# Altium project UC-526.PrjPCB (part 1 of 2)
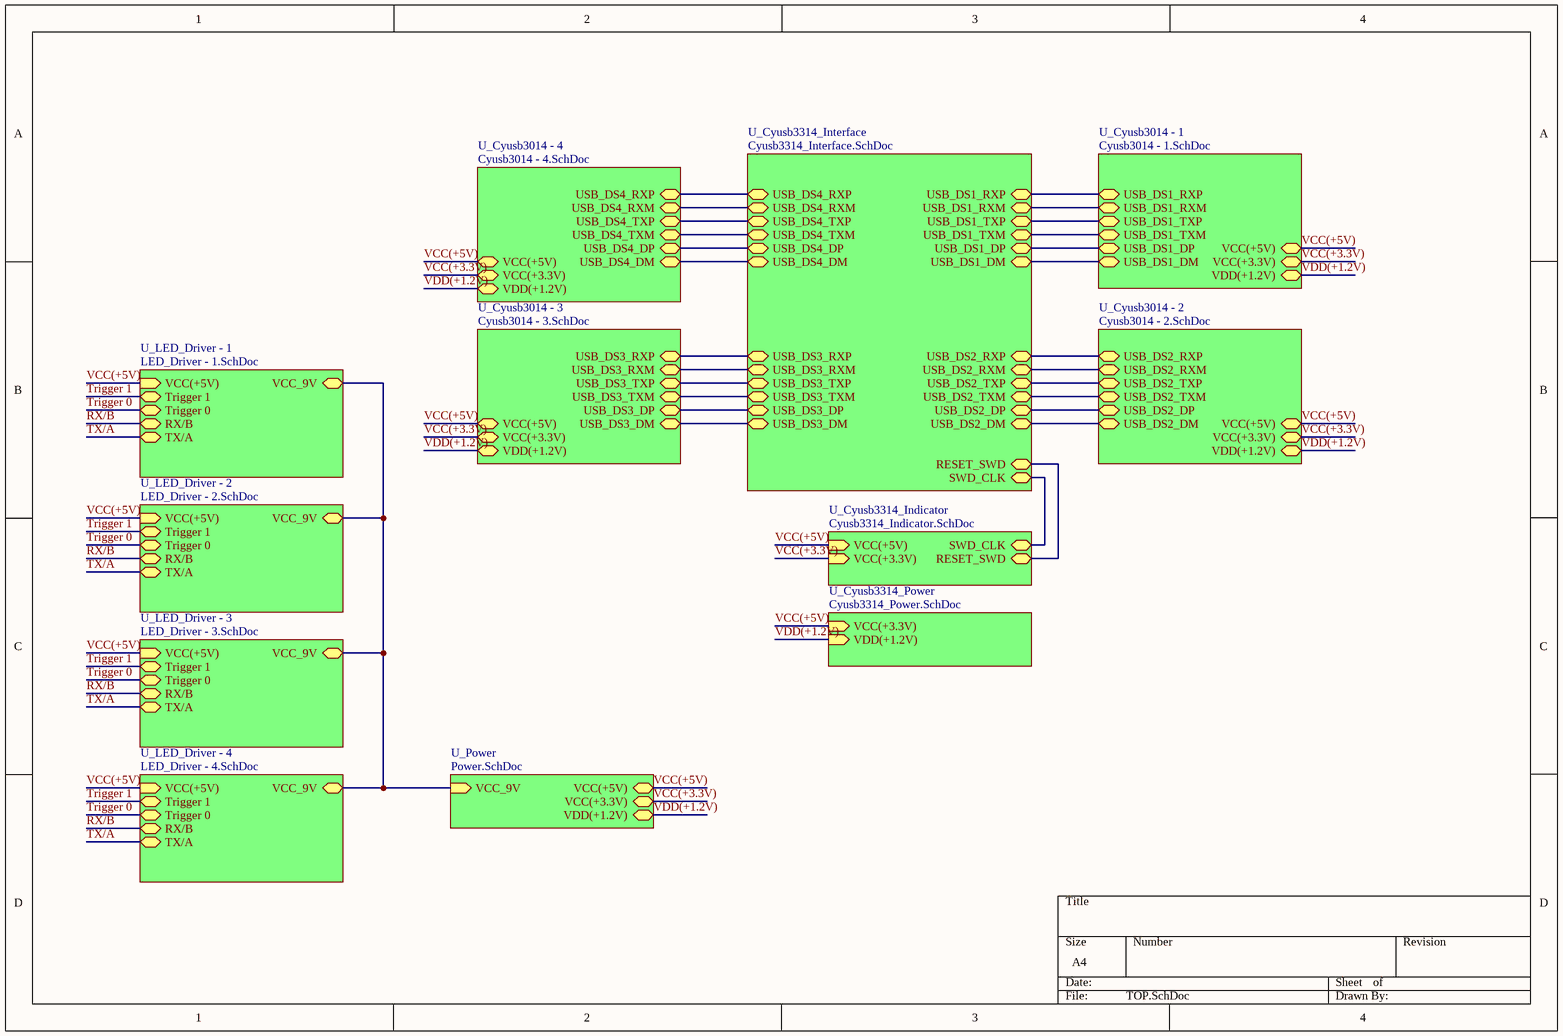
[diagram p0: TOP.SchDoc]
11 sheets, 578 parts. Net scope: hierarchical (ports join the sheet entries above them; power ports are global).
Board files: UC-526 - 1.PcbDoc, UC-526 - 2.PcbDoc, UC-526 - 3.PcbDoc, UC-526 - 4.PcbDoc, UC-526.PcbDoc
Sheets:
  TOP.SchDoc
    U_Power = Power.SchDoc
    U_Cyusb3014 - 2 = Cyusb3014 - 2.SchDoc
    U_Cyusb3014 - 4 = Cyusb3014 - 4.SchDoc
    U_Cyusb3314_Indicator = Cyusb3314_Indicator.SchDoc
    U_Cyusb3314_Interface = Cyusb3314_Interface.SchDoc
    U_Cyusb3314_Power = Cyusb3314_Power.SchDoc
    U_LED_Driver - 1 = LED_Driver - 1.SchDoc
    U_LED_Driver - 2 = LED_Driver - 2.SchDoc
    U_LED_Driver - 3 = LED_Driver - 3.SchDoc
    U_LED_Driver - 4 = LED_Driver - 4.SchDoc

## Sheet TOP.SchDoc
size A4

### Sub-sheets
U_Cyusb3014 - 1 = Cyusb3014 - 1.SchDoc (file not in this document): USB_DS1_RXP (bidir), USB_DS1_RXM (bidir), USB_DS1_TXP (bidir), USB_DS1_TXM (bidir), USB_DS1_DP (bidir), USB_DS1_DM (bidir), VCC(+5V) (bidir), VCC(+3.3V) (bidir), VDD(+1.2V) (bidir)
U_Cyusb3014 - 2 = Cyusb3014 - 2.SchDoc: USB_DS2_RXP (bidir), USB_DS2_RXM (bidir), USB_DS2_TXP (bidir), USB_DS2_TXM (bidir), USB_DS2_DP (bidir), USB_DS2_DM (bidir), VCC(+5V) (bidir), VCC(+3.3V) (bidir), VDD(+1.2V) (bidir)
U_Cyusb3014 - 3 = Cyusb3014 - 3.SchDoc (file not in this document): USB_DS3_RXP (bidir), USB_DS3_RXM (bidir), USB_DS3_TXP (bidir), USB_DS3_TXM (bidir), USB_DS3_DP (bidir), USB_DS3_DM (bidir), VCC(+5V) (bidir), VCC(+3.3V) (bidir), VDD(+1.2V) (bidir)
U_Cyusb3014 - 4 = Cyusb3014 - 4.SchDoc: USB_DS4_RXP (bidir), USB_DS4_RXM (bidir), USB_DS4_TXP (bidir), USB_DS4_TXM (bidir), USB_DS4_DP (bidir), USB_DS4_DM (bidir), VCC(+5V) (bidir), VCC(+3.3V) (bidir), VDD(+1.2V) (bidir)
U_Cyusb3314_Indicator = Cyusb3314_Indicator.SchDoc: SWD_CLK (bidir), RESET_SWD (bidir), VCC(+5V) (in), VCC(+3.3V) (in)
U_Cyusb3314_Interface = Cyusb3314_Interface.SchDoc: RESET_SWD (bidir), SWD_CLK (bidir), USB_DS1_RXP (bidir), USB_DS1_RXM (bidir), USB_DS1_TXP (bidir), USB_DS1_TXM (bidir), USB_DS1_DP (bidir), USB_DS1_DM (bidir), USB_DS2_RXP (bidir), USB_DS2_RXM (bidir), USB_DS2_TXP (bidir), USB_DS2_TXM (bidir), USB_DS2_DP (bidir), USB_DS2_DM (bidir), USB_DS3_RXP (bidir), USB_DS3_RXM (bidir), USB_DS3_TXP (bidir), USB_DS3_TXM (bidir), USB_DS3_DP (bidir), USB_DS3_DM (bidir), USB_DS4_RXP (bidir), USB_DS4_RXM (bidir), USB_DS4_TXP (bidir), USB_DS4_TXM (bidir), USB_DS4_DP (bidir), USB_DS4_DM (bidir)
U_Cyusb3314_Power = Cyusb3314_Power.SchDoc: VCC(+3.3V) (in), VDD(+1.2V) (in)
U_LED_Driver - 1 = LED_Driver - 1.SchDoc: VCC_9V (bidir), VCC(+5V) (in), Trigger 1 (bidir), Trigger 0 (bidir), RX/B (bidir), TX/A (bidir)
U_LED_Driver - 2 = LED_Driver - 2.SchDoc: VCC_9V (bidir), VCC(+5V) (in), Trigger 1 (bidir), Trigger 0 (bidir), RX/B (bidir), TX/A (bidir)
U_LED_Driver - 3 = LED_Driver - 3.SchDoc: VCC_9V (bidir), VCC(+5V) (in), Trigger 1 (bidir), Trigger 0 (bidir), RX/B (bidir), TX/A (bidir)
U_LED_Driver - 4 = LED_Driver - 4.SchDoc: VCC_9V (bidir), VCC(+5V) (in), Trigger 1 (bidir), Trigger 0 (bidir), RX/B (bidir), TX/A (bidir)
U_Power = Power.SchDoc: VCC_9V (in), VCC(+5V) (bidir), VCC(+3.3V) (bidir), VDD(+1.2V) (bidir)

### Nets
RX/B: sheet U_LED_Driver - 1/RX/B, sheet U_LED_Driver - 2/RX/B, sheet U_LED_Driver - 3/RX/B, sheet U_LED_Driver - 4/RX/B
Trigger 0: sheet U_LED_Driver - 1/Trigger 0, sheet U_LED_Driver - 2/Trigger 0, sheet U_LED_Driver - 3/Trigger 0, sheet U_LED_Driver - 4/Trigger 0
Trigger 1: sheet U_LED_Driver - 1/Trigger 1, sheet U_LED_Driver - 2/Trigger 1, sheet U_LED_Driver - 3/Trigger 1, sheet U_LED_Driver - 4/Trigger 1
TX/A: sheet U_LED_Driver - 1/TX/A, sheet U_LED_Driver - 2/TX/A, sheet U_LED_Driver - 3/TX/A, sheet U_LED_Driver - 4/TX/A
USB_DS1_DM: sheet U_Cyusb3014 - 1/USB_DS1_DM, sheet U_Cyusb3314_Interface/USB_DS1_DM
USB_DS1_DP: sheet U_Cyusb3014 - 1/USB_DS1_DP, sheet U_Cyusb3314_Interface/USB_DS1_DP
USB_DS1_RXM: sheet U_Cyusb3014 - 1/USB_DS1_RXM, sheet U_Cyusb3314_Interface/USB_DS1_RXM
USB_DS1_RXP: sheet U_Cyusb3014 - 1/USB_DS1_RXP, sheet U_Cyusb3314_Interface/USB_DS1_RXP
USB_DS1_TXM: sheet U_Cyusb3014 - 1/USB_DS1_TXM, sheet U_Cyusb3314_Interface/USB_DS1_TXM
USB_DS1_TXP: sheet U_Cyusb3014 - 1/USB_DS1_TXP, sheet U_Cyusb3314_Interface/USB_DS1_TXP
USB_DS2_DM: sheet U_Cyusb3014 - 2/USB_DS2_DM, sheet U_Cyusb3314_Interface/USB_DS2_DM
USB_DS2_DP: sheet U_Cyusb3014 - 2/USB_DS2_DP, sheet U_Cyusb3314_Interface/USB_DS2_DP
USB_DS2_RXM: sheet U_Cyusb3014 - 2/USB_DS2_RXM, sheet U_Cyusb3314_Interface/USB_DS2_RXM
USB_DS2_RXP: sheet U_Cyusb3014 - 2/USB_DS2_RXP, sheet U_Cyusb3314_Interface/USB_DS2_RXP
USB_DS2_TXM: sheet U_Cyusb3014 - 2/USB_DS2_TXM, sheet U_Cyusb3314_Interface/USB_DS2_TXM
USB_DS2_TXP: sheet U_Cyusb3014 - 2/USB_DS2_TXP, sheet U_Cyusb3314_Interface/USB_DS2_TXP
USB_DS3_DM: sheet U_Cyusb3014 - 3/USB_DS3_DM, sheet U_Cyusb3314_Interface/USB_DS3_DM
USB_DS3_DP: sheet U_Cyusb3014 - 3/USB_DS3_DP, sheet U_Cyusb3314_Interface/USB_DS3_DP
USB_DS3_RXM: sheet U_Cyusb3014 - 3/USB_DS3_RXM, sheet U_Cyusb3314_Interface/USB_DS3_RXM
USB_DS3_RXP: sheet U_Cyusb3014 - 3/USB_DS3_RXP, sheet U_Cyusb3314_Interface/USB_DS3_RXP
USB_DS3_TXM: sheet U_Cyusb3014 - 3/USB_DS3_TXM, sheet U_Cyusb3314_Interface/USB_DS3_TXM
USB_DS3_TXP: sheet U_Cyusb3014 - 3/USB_DS3_TXP, sheet U_Cyusb3314_Interface/USB_DS3_TXP
USB_DS4_DM: sheet U_Cyusb3014 - 4/USB_DS4_DM, sheet U_Cyusb3314_Interface/USB_DS4_DM
USB_DS4_DM: sheet U_Cyusb3014 - 4/USB_DS4_DP, sheet U_Cyusb3314_Interface/USB_DS4_DP  [a separate net that carries the same name]
USB_DS4_RXM: sheet U_Cyusb3014 - 4/USB_DS4_RXM, sheet U_Cyusb3314_Interface/USB_DS4_RXM
USB_DS4_RXP: sheet U_Cyusb3014 - 4/USB_DS4_RXP, sheet U_Cyusb3314_Interface/USB_DS4_RXP
USB_DS4_TXM: sheet U_Cyusb3014 - 4/USB_DS4_TXM, sheet U_Cyusb3314_Interface/USB_DS4_TXM
USB_DS4_TXP: sheet U_Cyusb3014 - 4/USB_DS4_TXP, sheet U_Cyusb3314_Interface/USB_DS4_TXP
VCC(+3.3V): sheet U_Power/VCC(+3.3V), sheet U_Cyusb3014 - 1/VCC(+3.3V), sheet U_Cyusb3014 - 2/VCC(+3.3V), sheet U_Cyusb3014 - 3/VCC(+3.3V), sheet U_Cyusb3014 - 4/VCC(+3.3V), sheet U_Cyusb3314_Indicator/VCC(+3.3V)
VCC(+5V): sheet U_Power/VCC(+5V), sheet U_Cyusb3014 - 1/VCC(+5V), sheet U_Cyusb3014 - 2/VCC(+5V), sheet U_Cyusb3014 - 3/VCC(+5V), sheet U_Cyusb3014 - 4/VCC(+5V), sheet U_Cyusb3314_Indicator/VCC(+5V), sheet U_Cyusb3314_Power/VCC(+3.3V), sheet U_LED_Driver - 1/VCC(+5V), sheet U_LED_Driver - 2/VCC(+5V), sheet U_LED_Driver - 3/VCC(+5V), sheet U_LED_Driver - 4/VCC(+5V)
VDD(+1.2V): sheet U_Power/VDD(+1.2V), sheet U_Cyusb3014 - 1/VDD(+1.2V), sheet U_Cyusb3014 - 2/VDD(+1.2V), sheet U_Cyusb3014 - 3/VDD(+1.2V), sheet U_Cyusb3014 - 4/VDD(+1.2V), sheet U_Cyusb3314_Power/VDD(+1.2V)
NetC188_1: sheet U_Cyusb3314_Indicator/RESET_SWD, sheet U_Cyusb3314_Interface/RESET_SWD
NetJ11_4: sheet U_Cyusb3314_Indicator/SWD_CLK, sheet U_Cyusb3314_Interface/SWD_CLK
(unnamed): sheet U_Power/VCC_9V, sheet U_LED_Driver - 1/VCC_9V, sheet U_LED_Driver - 2/VCC_9V, sheet U_LED_Driver - 3/VCC_9V, sheet U_LED_Driver - 4/VCC_9V

## Sheet Power.SchDoc
size A4
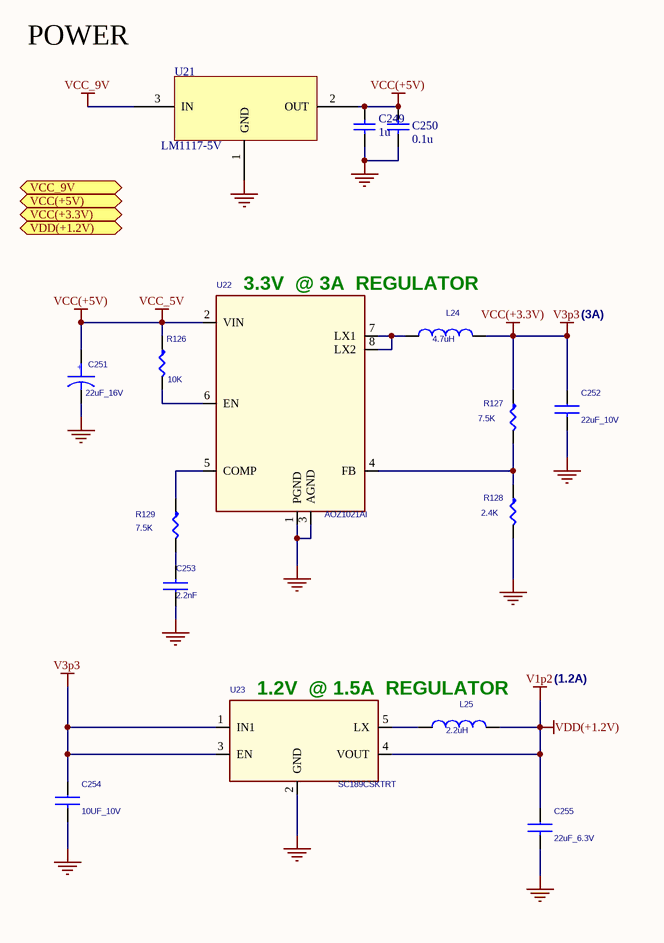
[diagram p1: Power.SchDoc]

### Parts
C249  1u  [C0603]
C250  0.1u  [C0603]
C251  22uF_16V  [CAPCP3216X100M]
C252  22uF_10V  [CAPC3216X100M]
C253  2.2nF  [CAPC2112X70M]
C254  10UF_10V  [CAPC2012X145M]
C255  22uF_6.3V  [CAPC3216X100M]
L24  4.7uH  [IND_NR6028T4R7M]
L25  2.2uH  [INDP3225X240M]
R126  10K  [RESC1608X55M]
R127  7.5K  [RESC1608X55M]
R128  2.4K  [RESC1608X55M]
R129  7.5K  [RESC1608X55M]
U21  LM1117-5V  [SOT-223]
U22  AOZ1021AI  [SOIC127P600X175-8M]
U23  SC189CSKTRT  [SOT95P280X145-5M]

### Ports
VCC(+3.3V) (bidir), VCC(+5V) (bidir), VCC_9V (in), VDD(+1.2V) (bidir)

### Nets
GND: C249.1 C250.2 C251.2 C252.2 C253.1 C254.2 C255.2 R128.2 U21.1(GND) U22.1(PGND) U22.3(AGND) U23.2(GND)
V1p2: C255.1 L25.2 U23.4(VOUT)  [also labelled VDD(+1.2V)]  [project net DVDD12]
V3p3: C252.1 C254.1 L24.2 R127.1 U23.1(IN1) U23.3(EN)  [also labelled VCC(+3.3V)]  [project net SWD_IO]
VCC(+5V): C249.2 C250.1 C251.1 R126.1 U21.2(OUT) U22.2(VIN)  [also labelled VCC_5V]
VCC_9V: U21.3(IN)
NetC253_2: C253.2 R129.2
NetL24_1: L24.1 U22.7(LX1) U22.8(LX2)
NetL25_1: L25.1 U23.5(LX)
NetR126_2: R126.2 U22.6(EN)
NetR127_2: R127.2 R128.1 U22.4(FB)
NetR129_1: R129.1 U22.5(COMP)

### Notes on the sheet
- POWER
- 3.3V  @ 3A  REGULATOR
- (3A)
- 1.2V  @ 1.5A  REGULATOR
- (1.2A)
- (in symbol CAP POL) +

### Library data of the parts
C249 = Cap: 50V/8.2u/0805; Value: 100n; Published: 8-Jun-2000; LatestRevisionDate: 17-Jul-2002; LatestRevisionNote: Re-released for DXP Platform.; PackageReference: RAD-0.3; Publisher: Altium Limited
C250 = CAP0805: Capacitor; Value: 104; Published: 8-Jun-2000; Revision: July-2002: Re-released for DXP Platform.; Publisher: Altium Limited
C251 = CAP POL: CAP TANT 22UF 16V 10% 1206; Manufacturer: Nichicon; Part Number: F951C226KQAAQ2; RoHS Compliant: Yes; Lead Free Status: No
C252 C254 C255 = CAPACITOR NON-POL: Manufacturer: *; Part Number: *
C253 = CAPACITOR NON-POL: CAP CER 2200PF 50V 10% X7R 0805; Manufacturer: Yageo; Part Number: CC0805KRX7R9BB222; Num Pins: 2; RoHS Compliant: Yes; Lead Free: YES
L24 = INDUCTOR: INDUCTOR 4.7UH 2.7A 20% SMD; Part Number: NR6028T4R7M; Manufacturer: Taiyo Yuden; Lead Free: YES
L25 = INDUCTOR: INDUCTOR 2.2UH 1.20A 20% 1210; Part Number: NLCV32T-2R2M-PFR; Manufacturer: TDK Corporation; Lead Free: YES
R126 = R_Dup1: RES 10.0K OHM 1/10W 1% 0603 SMD; Manufacturer: Panasonic - ECG; Part Number: ERJ-3EKF1002V; Lead Free: YES
R127 = R_Dup1: RES 7.5K OHM 1/10W 1% 0603 SMD; Manufacturer: Panasonic - ECG; Part Number: ERJ-3EKF7501V; Lead Free: YES
R128 = R_Dup1: RES 2.4K OHM 1/10W 1% 0603 SMD; Manufacturer: Panasonic - ECG; Part Number: ERJ-3EKF2401V; Lead Free: YES
R129 = R_Dup1: RES 7.5K OHM 1/10W 1% 0603 SMD; Part Number: ERJ-3EKF7501V; Manufacturer: Panasonic - ECG; Lead Free: YES
U21 = AMS1117
U22 = AOZ1021AI: IC REG BUCK SYNC ADJ 3A 8SOIC; Manufacturer: Alpha & Omega Semiconductor Inc; Part Number: AOZ1021AI
U23 = SC189CSKTRT: IC REG BUCK SYNC 1.2V SOT23-5; Manufacturer: Semtech; Part Number: SC189CSKTRT

## Sheet Cyusb3014 - 2.SchDoc
size A3
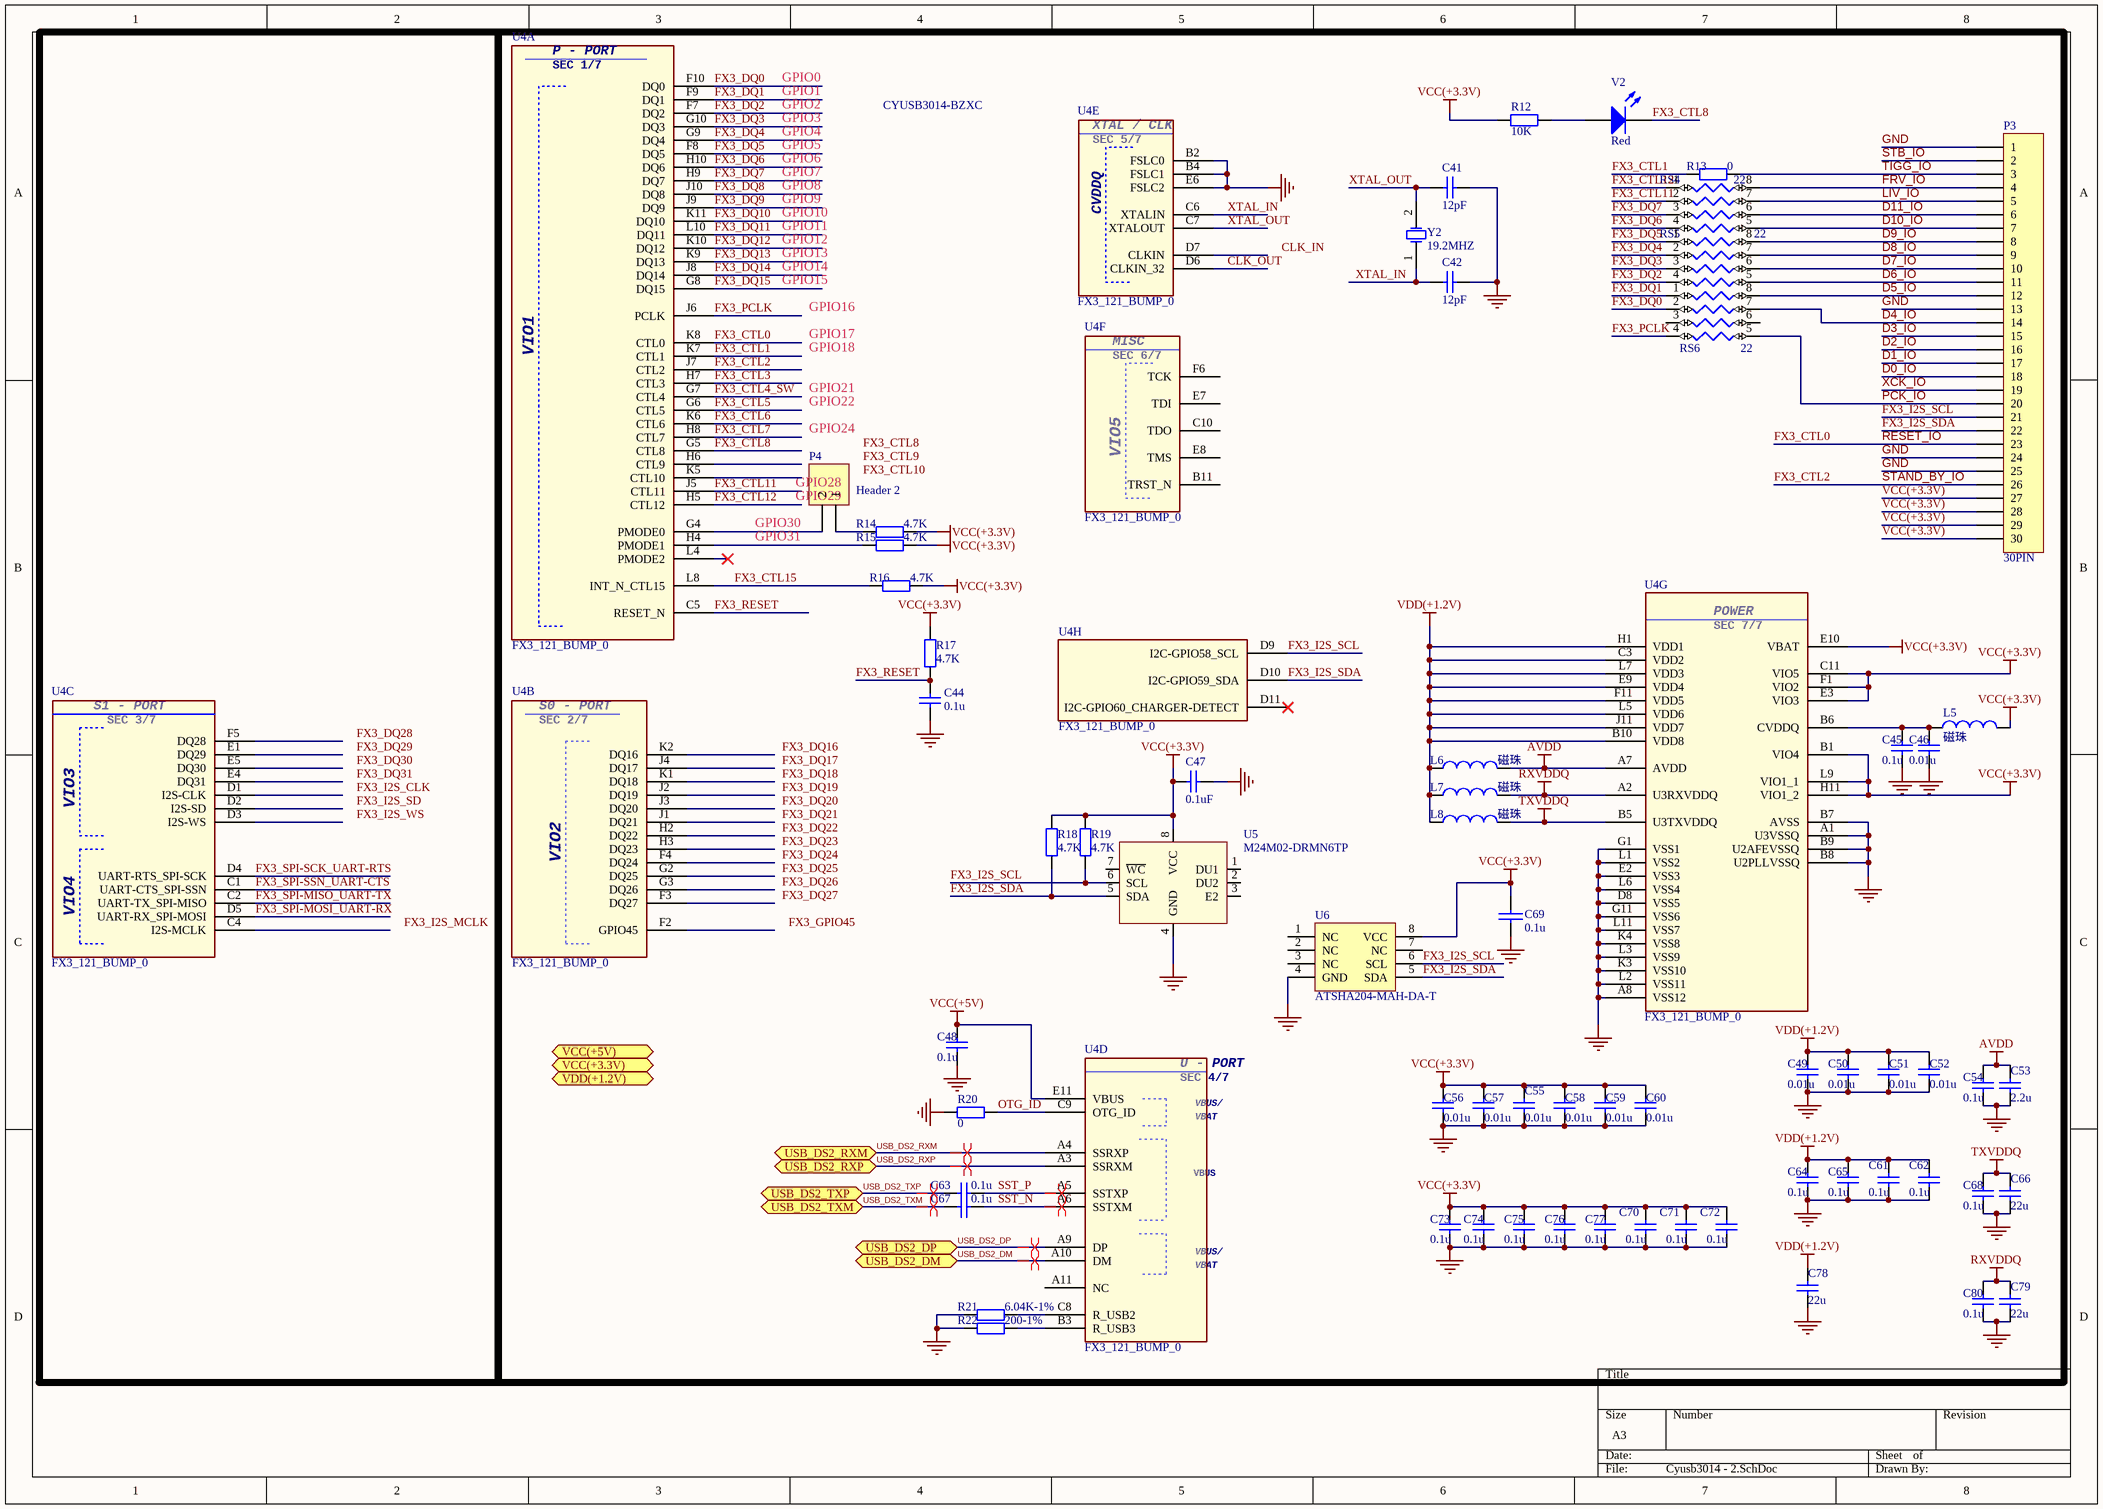
[diagram p2: Cyusb3014 - 2.SchDoc]

### Parts
C41  12pF  [0603S-CAP]
C42  12pF  [0603S-CAP]
C44  0.1u  [0603S-CAP]
C45  0.1u  [C0402]
C46  0.01u  [C0402]
C47  0.1uF  [0603S-CAP]
C48  0.1u  [C0402]
C49  0.01u  [C0402]
C50  0.01u  [C0402]
C51  0.01u  [C0402]
C52  0.01u  [C0402]
C53  2.2u  [C0805S-CAP]
C54  0.1u  [C0402]
C55  0.01u  [C0402]
C56  0.01u  [C0402]
C57  0.01u  [C0402]
C58  0.01u  [C0402]
C59  0.01u  [C0402]
C60  0.01u  [C0402]
C61  0.1u  [C0402]
C62  0.1u  [C0402]
C63  0.1u  [C0402]
C64  0.1u  [C0402]
C65  0.1u  [C0402]
C66  22u  [C0805S-CAP]
C67  0.1u  [C0402]
C68  0.1u  [C0402]
C69  0.1u  [0603S-CAP]
C70  0.1u  [C0402]
C71  0.1u  [C0402]
C72  0.1u  [C0402]
C73  0.1u  [C0402]
C74  0.1u  [C0402]
C75  0.1u  [C0402]
C76  0.1u  [C0402]
C77  0.1u  [C0402]
C78  22u  [C0805S-CAP]
C79  22u  [C0805S-CAP]
C80  0.1u  [C0402]
L5  磁珠  [L0603]
L6  磁珠  [L0603]
L7  磁珠  [L0603]
L8  磁珠  [L0603]
P3  30PIN  [FH12-30S-0.5SH]
P4  Header 2  [HDR1X2]
R12  10K  [0603S-RES]
R13  0  [0603S-RES]
R14  4.7K  [0603S-RES]
R15  4.7K  [0603S-RES]
R16  4.7K  [0603S-RES]
R17  4.7K  [0603S-RES]
R18  4.7K  [0603S-RES]
R19  4.7K  [0603S-RES]
R20  0  [0603S-RES]
R21  6.04K-1%  [0603S-RES]
R22  200-1%  [0603S-RES]
RS4  22  [NC06-4]
RS5  22  [NC06-4]
RS6  22  [NC06-4]
U4  FX3_121_BUMP_0  [121_BGA_FX3]  (parts A,B,C,D,E,F,G,H of 8)
U5  M24M02-DRMN6TP  [SOIC127P600X175-8N]
U6  ATSHA204-MAH-DA-T  [UDFN]
V2  Red  [LED0805S]
Y2  19.2MHZ  [爱普生晶振3.2×2.5MM - 无源]

### Ports
USB_DS2_DM (bidir), USB_DS2_DP (bidir), USB_DS2_RXM (bidir), USB_DS2_RXP (bidir), USB_DS2_TXM (bidir), USB_DS2_TXP (bidir), VCC(+3.3V) (bidir), VCC(+5V) (bidir), VDD(+1.2V) (bidir)

### Nets
AVDD: C53.2 C54.1 L6.2 U4.A7(AVDD)
GND: C41.1 C42.1 C44.1 C45.2 C46.2 C47.1 C48.2 C49.2 C50.2 C51.2 C52.2 C53.1 C54.2 C55.2 C56.2 C57.2 C58.2 C59.2 C60.2 C61.2 C62.2 C64.2 C65.2 C66.1 C68.2 C69.2 C70.2 C71.2 C72.2 C73.2 C74.2 C75.2 C76.2 C77.2 C78.1 C79.1 C80.2 P3.1 P3.13 P3.24 P3.25 R20.2 R21.2 R22.2 U4.A1(U3VSSQ) U4.A8(VSS12) U4.B2(FSLC0) U4.B4(FSLC1) U4.B7(AVSS) U4.B8(U2PLLVSSQ) U4.B9(U2AFEVSSQ) U4.D8(VSS5) U4.E2(VSS3) U4.E6(FSLC2) U4.G1(VSS1) U4.G11(VSS6) U4.K3(VSS10) U4.K4(VSS8) U4.L1(VSS2) U4.L2(VSS11) U4.L3(VSS9) U4.L6(VSS4) U4.L11(VSS7) U5.4(GND) U6.4(GND)
RXVDDQ: C79.2 C80.1 L7.2 U4.A2(U3RXVDDQ)
TXVDDQ: C66.2 C68.1 L8.2 U4.B5(U3TXVDDQ)
VCC(+3.3V): C47.2 C55.1 C56.1 C57.1 C58.1 C59.1 C60.1 C69.1 C70.1 C71.1 C72.1 C73.1 C74.1 C75.1 C76.1 C77.1 L5.2 P3.27 P3.28 P3.29 P3.30 R12.2 R14.2 R15.2 R16.1 R17.1 R18.2 R19.2 U4.B1(VIO4) U4.C11(VIO5) U4.E3(VIO3) U4.E10(VBAT) U4.F1(VIO2) U4.H11(VIO1_2) U4.L9(VIO1_1) U5.8(VCC) U6.8(VCC)  [project net SWD_IO]
VCC(+5V): C48.1 U4.E11(VBUS)
VDD(+1.2V): C49.1 C50.1 C51.1 C52.1 C61.1 C62.1 C64.1 C65.1 C78.2 L6.1 L7.1 L8.1 U4.B10(VDD8) U4.C3(VDD2) U4.E9(VDD4) U4.F11(VDD5) U4.H1(VDD1) U4.J11(VDD7) U4.L5(VDD6) U4.L7(VDD3)  [project net DVDD12]
CLK_OUT: U4.D6(CLKIN_32)
D0_IO: P3.18
D1_IO: P3.17
D2_IO: P3.16
D3_IO: P3.15
D4_IO: P3.14 RS6.7
D5_IO: P3.12 RS6.8
D6_IO: P3.11 RS5.5
D7_IO: P3.10 RS5.6
D8_IO: P3.9 RS5.7
D9_IO: P3.8 RS5.8
D10_IO: P3.7 RS4.5
D11_IO: P3.6 RS4.6
FRV_IO: P3.4 RS4.8
FX3_CTL0: P3.23 U4.K8(CTL0)  [also labelled RESET_IO]
FX3_CTL1: R13.2 U4.K7(CTL1)
FX3_CTL2: P3.26 U4.J7(CTL2)  [also labelled STAND_BY_IO]
FX3_CTL3: U4.H7(CTL3)
FX3_CTL4_SW: U4.G7(CTL4)
FX3_CTL5: U4.G6(CTL5)
FX3_CTL6: U4.K6(CTL6)
FX3_CTL7: U4.H8(CTL7)
FX3_CTL8: U4.G5(CTL8) V2.2(K)
FX3_CTL11: RS4.2 U4.J5(CTL11)
FX3_CTL12: RS4.1 U4.H5(CTL12)
FX3_CTL15: R16.2 U4.L8(INT_N_CTL15)
FX3_DQ0: RS6.2 U4.F10(DQ0)
FX3_DQ1: RS6.1 U4.F9(DQ1)
FX3_DQ2: RS5.4 U4.F7(DQ2)
FX3_DQ3: RS5.3 U4.G10(DQ3)
FX3_DQ4: RS5.2 U4.G9(DQ4)
FX3_DQ5: RS5.1 U4.F8(DQ5)
FX3_DQ6: RS4.4 U4.H10(DQ6)
FX3_DQ7: RS4.3 U4.H9(DQ7)
FX3_DQ8: U4.J10(DQ8)
FX3_DQ9: U4.J9(DQ9)
FX3_DQ10: U4.K11(DQ10)
FX3_DQ11: U4.L10(DQ11)
FX3_DQ12: U4.K10(DQ12)
FX3_DQ13: U4.K9(DQ13)
FX3_DQ14: U4.J8(DQ14)
FX3_DQ15: U4.G8(DQ15)
FX3_I2S_SCL: P3.21 R19.1 U4.D9(I2C-GPIO58_SCL) U5.6(SCL) U6.6(SCL)
FX3_I2S_SDA: P3.22 R18.1 U4.D10(I2C-GPIO59_SDA) U5.5(SDA) U6.5(SDA)
FX3_PCLK: RS6.4 U4.J6(PCLK)
FX3_RESET: C44.2 R17.2 U4.C5(RESET_N)
FX3_SPI-MISO_UART-TX: U4.C2(UART-TX_SPI-MISO)
FX3_SPI-MOSI_UART-RX: U4.D5(UART-RX_SPI-MOSI)
FX3_SPI-SCK_UART-RTS: U4.D4(UART-RTS_SPI-SCK)
FX3_SPI-SSN_UART-CTS: U4.C1(UART-CTS_SPI-SSN)
LIV_IO: P3.5 RS4.7
OTG_ID: R20.1 U4.C9(OTG_ID)
PCK_IO: P3.20 RS6.5
SST_N: C67.2 U4.A6(SSTXM)
SST_P: C63.2 U4.A5(SSTXP)
STB_IO: P3.2
TIGG_IO: P3.3 R13.1
USB_DS2_DM: U4.A10(DM) ; port USB_DS2_DM
USB_DS2_DP: U4.A9(DP) ; port USB_DS2_DP
USB_DS2_RXM: U4.A4(SSRXP) ; port USB_DS2_RXM
USB_DS2_RXP: U4.A3(SSRXM) ; port USB_DS2_RXP
USB_DS2_TXM: C67.1 ; port USB_DS2_TXM
USB_DS2_TXP: C63.1 ; port USB_DS2_TXP
XCK_IO: P3.19
XTAL_IN: C42.2 U4.C6(XTALIN) Y2.1(OSC1)
XTAL_OUT: C41.2 U4.C7(XTALOUT) Y2.2(OSC2)
NetC45_1: C45.1 C46.1 L5.1 U4.B6(CVDDQ)
NetP4_1: P4.1 R14.1
NetP4_2: P4.2 U4.G4(PMODE0)
NetR12_1: R12.1 V2.1(A)
NetR15_1: R15.1 U4.H4(PMODE1)
NetR21_1: R21.1 U4.C8(R_USB2)
NetR22_1: R22.1 U4.B3(R_USB3)

Not connected (* = marked no-connect by the designer): RS6 3 6; U4 A11(NC) B11(TRST_N) C4(I2S-MCLK) C10(TDO) D1(I2S-CLK) D2(I2S-SD) D3(I2S-WS) D7(CLKIN) D11(I2C-GPIO60_CHARGER-DETECT)* E1(DQ29) E4(DQ31) E5(DQ30) E7(TDI) E8(TMS) F2(GPIO45) F3(DQ27) F4(DQ24) F5(DQ28) F6(TCK) G2(DQ25) G3(DQ26) H2(DQ22) H3(DQ23) H6(CTL9) J1(DQ21) J2(DQ19) J3(DQ20) J4(DQ17) K1(DQ18) K2(DQ16) K5(CTL10) L4(PMODE2)*; U5 1(DU1) 2(DU2) 3(E2) 7(~{WC}); U6 1(NC) 2(NC) 3(NC) 7(NC)

### Layout directives
differential pair: SST_N, SST_P, USB_DS2_DM, USB_DS2_DP, USB_DS2_RXM, USB_DS2_RXP, USB_DS2_TXM, USB_DS2_TXP

### Notes on the sheet
- GPIO0
- GPIO1
- GPIO2
- CYUSB3014-BZXC
- GPIO3
- GPIO4
- GPIO5
- GPIO6
- GPIO7
- GPIO8
- GPIO9
- GPIO10
- GPIO11
- GPIO12
- GPIO13
- GPIO14
- GPIO15
- GPIO16
- GPIO17
- GPIO18
- GPIO21
- GPIO22
- GPIO24
- (near P4) GPIO28
- (near P4) GPIO29
- (near P4) GPIO30
- (near P4) GPIO31
- Labels drawn without touching a wire or pin: CLK_IN, FX3_CTL8, FX3_CTL9, FX3_CTL10, FX3_DQ16, FX3_DQ17, FX3_DQ18, FX3_DQ19, FX3_DQ20, FX3_DQ21, FX3_DQ22, FX3_DQ23, FX3_DQ24, FX3_DQ25, FX3_DQ26, FX3_DQ27, FX3_DQ28, FX3_DQ29, FX3_DQ30, FX3_DQ31, FX3_GPIO45, FX3_I2S_CLK, FX3_I2S_MCLK, FX3_I2S_SD, FX3_I2S_WS
- (in symbol FX3_121_BUMP_0, part A) P - PORT; SEC 1/7; VIO1
- (in symbol FX3_121_BUMP_0, part B) S0 - PORT; SEC 2/7
- (in symbol FX3_121_BUMP_0, part C) S1 - PORT; SEC 3/7
- (in symbol FX3_121_BUMP_0, part D) U - PORT; SEC 4/7; VBUS/
- (in symbol FX3_121_BUMP_0, part E) XTAL / CLK; SEC 5/7
- (in symbol FX3_121_BUMP_0, part F) MISC; SEC 6/7
- (in symbol FX3_121_BUMP_0, part G) POWER; SEC 7/7

### Library data of the parts
C41 C42 = CAP CER SMT 4.3pF 0805: 2. Manufacturere Part Number: C0805C439D5GACTU; 1. Manufacturer: Kemet; 8. Alternate Part: any; 7. Package / Case: 0805; 0. Do Not Install: DNI; 6. Mounting Type: SMT; 5. Supplier Link: http://www.digikey.com/product-detail/en/C0805C439D5GACTU/C0805C439D5GACTU-ND/2212763; 3. Supplier: Digi-Key; 4. Supplier Part Number: C0805C439D5GACTU-ND
C44 = Cap: 50V/8.2u/0805; Value: 100n; Published: 8-Jun-2000; LatestRevisionDate: 17-Jul-2002; LatestRevisionNote: Re-released for DXP Platform.; PackageReference: RAD-0.3; Publisher: Altium Limited
C45 C46 C48-C68 C70-C80 = CAP0805: Capacitor; Value: 104; Published: 8-Jun-2000; Revision: July-2002: Re-released for DXP Platform.; Publisher: Altium Limited
C47 = CAP SMT 0.1uF 16V X7R: 2. Manufacturere Part Number: C0805C104K4RACTU; 1. Manufacturer: Kemet; 8. Alternate Part: any; 7. Package / Case: 0805; 6. Mounting Type: SMT; 5. Supplier Link: http://www.digikey.com/product-detail/en/C0805C104K4RACTU/399-1167-1-ND/411442; 3. Supplier: Digi-Key; 4. Supplier Part Number: 399-1167-1-ND
C69 = CAP: RC=1206
L5-L8 = Inductor: Code_IEC: 1005; Value: 10mH; Published: 8-Jun-2000; LatestRevisionDate: 29-May-2009; LatestRevisionNote: IPC-7351 Footprint Added.; PackageReference: 0402-A; Publisher: Altium Limited; PackageDescription: Chip Inductor; Code_JEITA: 0402
P3 = Header 30: Header, 30-Pin; LatestRevisionDate: 17-Jul-2002; LatestRevisionNote: Re-released for DXP Platform.; Publisher: Altium Limited
P4 = Header 2: Header, 2-Pin; LatestRevisionDate: 17-Jul-2002; LatestRevisionNote: Re-released for DXP Platform.; Publisher: Altium Limited
R12 = Res2: Resistor; Published: 8-Jun-2000; LatestRevisionDate: 17-Jul-2002; LatestRevisionNote: Re-released for DXP Platform.; PackageReference: AXIAL-0.4; Publisher: Altium Limited; Value: 10K
R13-R22 = Res2: Resistor; Value: 10K; Published: 8-Jun-2000; LatestRevisionDate: 17-Jul-2002; LatestRevisionNote: Re-released for DXP Platform.; PackageReference: AXIAL-0.4; Publisher: Altium Limited
RS4-RS6 = RN4: Option 2 - Device: *; Option 2 - Spec: *; Option 3 - Device: *; Option 3 - Spec: *; Option 4 - Device: *; Option 4 - Spec: *; Option 5 - Device: *; Option 5 - Spec: *; Option 6 - Device: *; Option 6 - Spec: *; Option 7 - Device: *; Option 7 - Spec: *; Option 8 - Device: *; Option 8 - Spec: *
U5 = 24LC64-I/SN: IC EEPROM 64KBIT 400KHZ 8SOIC; Manufacturer: Microchip Technology; Format - Memory: EEPROMs - Serial; Memory Size: 64K (8K x 8); Interface: I2C, 2-Wire Serial; Voltage - Supply: 2.5 V ~ 5.5 V; Supplier 1: Digi-Key; Manufacturer Part Number: 24LC64-I/SN; RoHS: RoHS Compliant; Category: Integrated Circuits (ICs); Stock 1: 16323; Pricing 1: 1=0.38, 25=0.37, 100=0.35 (USD); Packaging: Tube; Memory Type: EEPROM; Speed: 400kHz; Operating Temperature: -40°C ~ 85°C (TA); Package / Case: 8-SOIC (0.154", 3.90mm Width); Supplier Device Package: 8-SOIC; ComponentLink1URL: http://www.microchip.com/mymicrochip/filehandler.aspx?ddocname=en011843; ComponentLink1Description: http://www.microchip.com/mymicrochip/filehandler.aspx?ddocname=en011843; Supplier Part Number 1: 24LC64-I/SN-ND
U6 = AT24C128
V2 = LED0: Typical INFRARED GaAs LED; Published: 8-Jun-2000; LatestRevisionDate: 08-Jul-2005; LatestRevisionNote: Mech Layer 1 removed.; PackageReference: LED-0; Publisher: Altium Limited
Y2 = XTAL 32.768KHZ: Crystal, CRYSTAL 32.768KHZ 6PF SMD; 2. Manufacturere Part Number: ABS07-120-32.768KHZ-T; 1. Manufacturer: Abracon; 6. Mounting Type: SMT; 9. Notes: 2 pad - Abracon ABS07-120-32.768KHZ-T, 4 pad - Abracon ABS25-32.768KHZ-6-T; 0. Do Not Install: DNI; 5. Supplier Link: http://www.digikey.com/product-detail/en/ABS07-120-32.768KHZ-T/535-11937-1-ND/3724046; 3. Supplier: Digi-Key; 4. Supplier Part Number: 535-11937-1-ND

## Sheet Cyusb3014 - 4.SchDoc
size A3
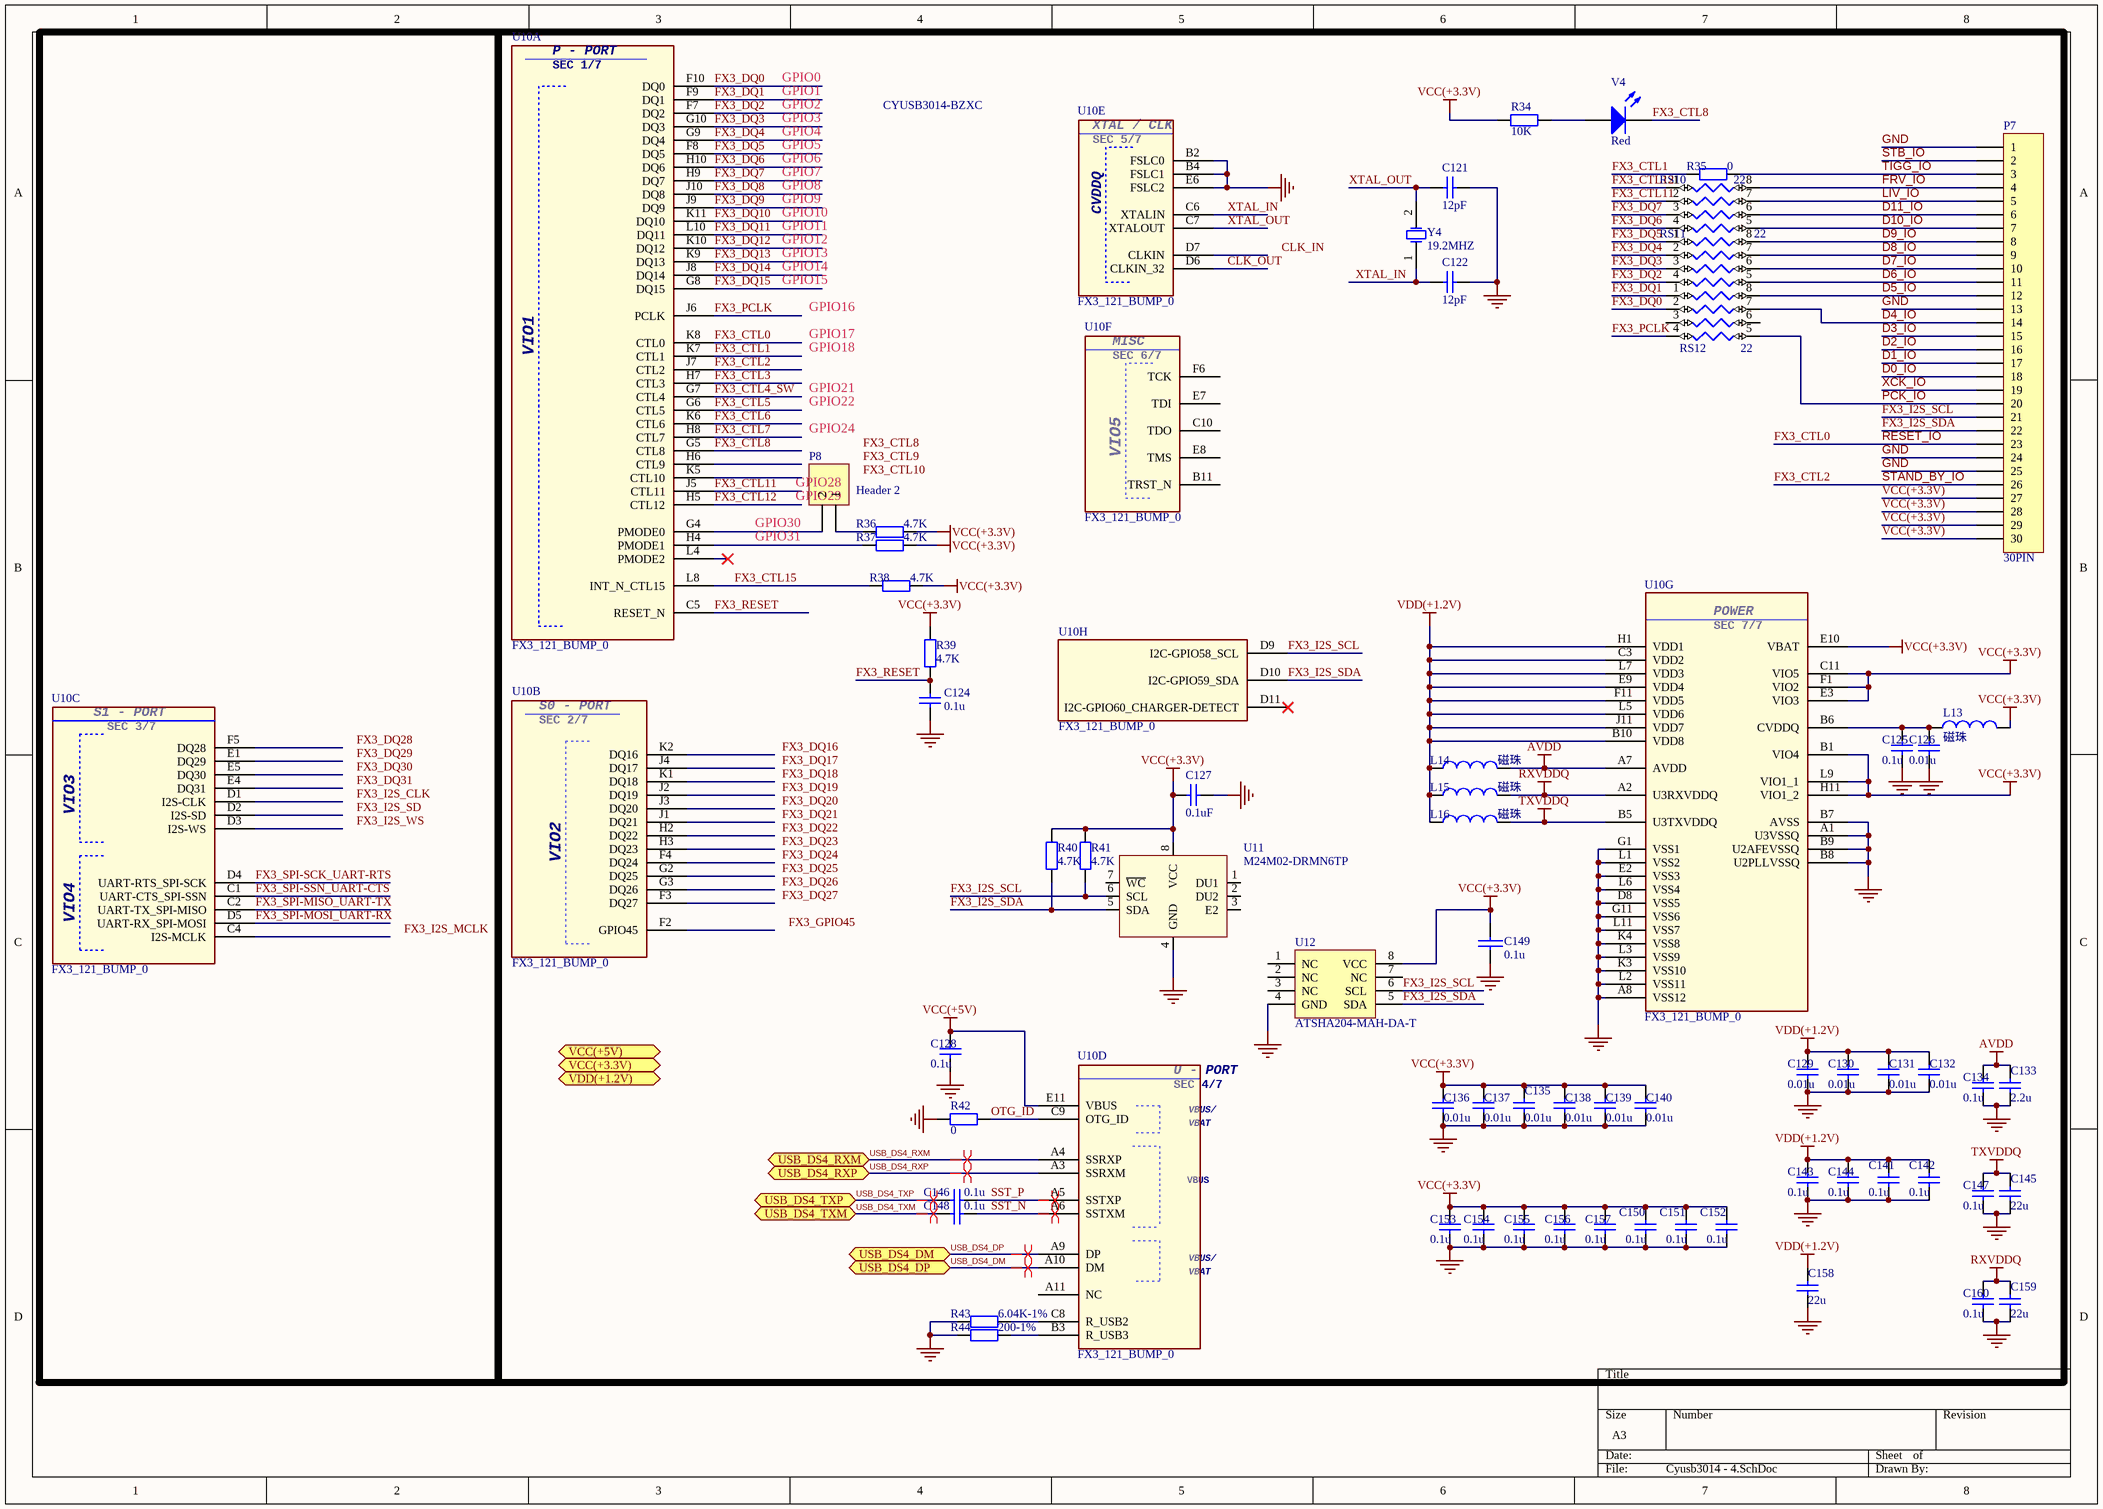
[diagram p3: Cyusb3014 - 4.SchDoc]

### Parts
C121  12pF  [0603S-CAP]
C122  12pF  [0603S-CAP]
C124  0.1u  [0603S-CAP]
C125  0.1u  [C0402]
C126  0.01u  [C0402]
C127  0.1uF  [0603S-CAP]
C128  0.1u  [C0402]
C129  0.01u  [C0402]
C130  0.01u  [C0402]
C131  0.01u  [C0402]
C132  0.01u  [C0402]
C133  2.2u  [C0805S-CAP]
C134  0.1u  [C0402]
C135  0.01u  [C0402]
C136  0.01u  [C0402]
C137  0.01u  [C0402]
C138  0.01u  [C0402]
C139  0.01u  [C0402]
C140  0.01u  [C0402]
C141  0.1u  [C0402]
C142  0.1u  [C0402]
C143  0.1u  [C0402]
C144  0.1u  [C0402]
C145  22u  [C0805S-CAP]
C146  0.1u  [C0402]
C147  0.1u  [C0402]
C148  0.1u  [C0402]
C149  0.1u  [0603S-CAP]
C150  0.1u  [C0402]
C151  0.1u  [C0402]
C152  0.1u  [C0402]
C153  0.1u  [C0402]
C154  0.1u  [C0402]
C155  0.1u  [C0402]
C156  0.1u  [C0402]
C157  0.1u  [C0402]
C158  22u  [C0805S-CAP]
C159  22u  [C0805S-CAP]
C160  0.1u  [C0402]
L13  磁珠  [L0603]
L14  磁珠  [L0603]
L15  磁珠  [L0603]
L16  磁珠  [L0603]
P7  30PIN  [FH12-30S-0.5SH]
P8  Header 2  [HDR1X2]
R34  10K  [0603S-RES]
R35  0  [0603S-RES]
R36  4.7K  [0603S-RES]
R37  4.7K  [0603S-RES]
R38  4.7K  [0603S-RES]
R39  4.7K  [0603S-RES]
R40  4.7K  [0603S-RES]
R41  4.7K  [0603S-RES]
R42  0  [0603S-RES]
R43  6.04K-1%  [0603S-RES]
R44  200-1%  [0603S-RES]
RS10  22  [NC06-4]
RS11  22  [NC06-4]
RS12  22  [NC06-4]
U10  FX3_121_BUMP_0  [121_BGA_FX3]  (parts A,B,C,D,E,F,G,H of 8)
U11  M24M02-DRMN6TP  [SOIC127P600X175-8N]
U12  ATSHA204-MAH-DA-T  [UDFN]
V4  Red  [LED0805S]
Y4  19.2MHZ  [爱普生晶振3.2×2.5MM - 无源]

### Ports
USB_DS4_DM (bidir), USB_DS4_DP (bidir), USB_DS4_RXM (bidir), USB_DS4_RXP (bidir), USB_DS4_TXM (bidir), USB_DS4_TXP (bidir), VCC(+3.3V) (bidir), VCC(+5V) (bidir), VDD(+1.2V) (bidir)

### Nets
AVDD: C133.2 C134.1 L14.2 U10.A7(AVDD)
GND: C121.1 C122.1 C124.1 C125.2 C126.2 C127.1 C128.2 C129.2 C130.2 C131.2 C132.2 C133.1 C134.2 C135.2 C136.2 C137.2 C138.2 C139.2 C140.2 C141.2 C142.2 C143.2 C144.2 C145.1 C147.2 C149.2 C150.2 C151.2 C152.2 C153.2 C154.2 C155.2 C156.2 C157.2 C158.1 C159.1 C160.2 P7.1 P7.13 P7.24 P7.25 R42.2 R43.2 R44.2 U10.A1(U3VSSQ) U10.A8(VSS12) U10.B2(FSLC0) U10.B4(FSLC1) U10.B7(AVSS) U10.B8(U2PLLVSSQ) U10.B9(U2AFEVSSQ) U10.D8(VSS5) U10.E2(VSS3) U10.E6(FSLC2) U10.G1(VSS1) U10.G11(VSS6) U10.K3(VSS10) U10.K4(VSS8) U10.L1(VSS2) U10.L2(VSS11) U10.L3(VSS9) U10.L6(VSS4) U10.L11(VSS7) U11.4(GND) U12.4(GND)
RXVDDQ: C159.2 C160.1 L15.2 U10.A2(U3RXVDDQ)
TXVDDQ: C145.2 C147.1 L16.2 U10.B5(U3TXVDDQ)
VCC(+3.3V): C127.2 C135.1 C136.1 C137.1 C138.1 C139.1 C140.1 C149.1 C150.1 C151.1 C152.1 C153.1 C154.1 C155.1 C156.1 C157.1 L13.2 P7.27 P7.28 P7.29 P7.30 R34.2 R36.2 R37.2 R38.1 R39.1 R40.2 R41.2 U10.B1(VIO4) U10.C11(VIO5) U10.E3(VIO3) U10.E10(VBAT) U10.F1(VIO2) U10.H11(VIO1_2) U10.L9(VIO1_1) U11.8(VCC) U12.8(VCC)  [project net SWD_IO]
VCC(+5V): C128.1 U10.E11(VBUS)
VDD(+1.2V): C129.1 C130.1 C131.1 C132.1 C141.1 C142.1 C143.1 C144.1 C158.2 L14.1 L15.1 L16.1 U10.B10(VDD8) U10.C3(VDD2) U10.E9(VDD4) U10.F11(VDD5) U10.H1(VDD1) U10.J11(VDD7) U10.L5(VDD6) U10.L7(VDD3)  [project net DVDD12]
CLK_OUT: U10.D6(CLKIN_32)
D0_IO: P7.18
D1_IO: P7.17
D2_IO: P7.16
D3_IO: P7.15
D4_IO: P7.14 RS12.7
D5_IO: P7.12 RS12.8
D6_IO: P7.11 RS11.5
D7_IO: P7.10 RS11.6
D8_IO: P7.9 RS11.7
D9_IO: P7.8 RS11.8
D10_IO: P7.7 RS10.5
D11_IO: P7.6 RS10.6
FRV_IO: P7.4 RS10.8
FX3_CTL0: P7.23 U10.K8(CTL0)  [also labelled RESET_IO]
FX3_CTL1: R35.2 U10.K7(CTL1)
FX3_CTL2: P7.26 U10.J7(CTL2)  [also labelled STAND_BY_IO]
FX3_CTL3: U10.H7(CTL3)
FX3_CTL4_SW: U10.G7(CTL4)
FX3_CTL5: U10.G6(CTL5)
FX3_CTL6: U10.K6(CTL6)
FX3_CTL7: U10.H8(CTL7)
FX3_CTL8: U10.G5(CTL8) V4.2(K)
FX3_CTL11: RS10.2 U10.J5(CTL11)
FX3_CTL12: RS10.1 U10.H5(CTL12)
FX3_CTL15: R38.2 U10.L8(INT_N_CTL15)
FX3_DQ0: RS12.2 U10.F10(DQ0)
FX3_DQ1: RS12.1 U10.F9(DQ1)
FX3_DQ2: RS11.4 U10.F7(DQ2)
FX3_DQ3: RS11.3 U10.G10(DQ3)
FX3_DQ4: RS11.2 U10.G9(DQ4)
FX3_DQ5: RS11.1 U10.F8(DQ5)
FX3_DQ6: RS10.4 U10.H10(DQ6)
FX3_DQ7: RS10.3 U10.H9(DQ7)
FX3_DQ8: U10.J10(DQ8)
FX3_DQ9: U10.J9(DQ9)
FX3_DQ10: U10.K11(DQ10)
FX3_DQ11: U10.L10(DQ11)
FX3_DQ12: U10.K10(DQ12)
FX3_DQ13: U10.K9(DQ13)
FX3_DQ14: U10.J8(DQ14)
FX3_DQ15: U10.G8(DQ15)
FX3_I2S_SCL: P7.21 R41.1 U10.D9(I2C-GPIO58_SCL) U11.6(SCL) U12.6(SCL)
FX3_I2S_SDA: P7.22 R40.1 U10.D10(I2C-GPIO59_SDA) U11.5(SDA) U12.5(SDA)
FX3_PCLK: RS12.4 U10.J6(PCLK)
FX3_RESET: C124.2 R39.2 U10.C5(RESET_N)
FX3_SPI-MISO_UART-TX: U10.C2(UART-TX_SPI-MISO)
FX3_SPI-MOSI_UART-RX: U10.D5(UART-RX_SPI-MOSI)
FX3_SPI-SCK_UART-RTS: U10.D4(UART-RTS_SPI-SCK)
FX3_SPI-SSN_UART-CTS: U10.C1(UART-CTS_SPI-SSN)
LIV_IO: P7.5 RS10.7
OTG_ID: R42.1 U10.C9(OTG_ID)
PCK_IO: P7.20 RS12.5
SST_N: C148.2 U10.A6(SSTXM)
SST_P: C146.2 U10.A5(SSTXP)
STB_IO: P7.2
TIGG_IO: P7.3 R35.1
USB_DS4_DM: U10.A10(DM) ; port USB_DS4_DP
USB_DS4_DP: U10.A9(DP) ; port USB_DS4_DM  [project net USB_DS4_DM]
USB_DS4_RXM: U10.A4(SSRXP) ; port USB_DS4_RXM
USB_DS4_RXP: U10.A3(SSRXM) ; port USB_DS4_RXP
USB_DS4_TXM: C148.1 ; port USB_DS4_TXM
USB_DS4_TXP: C146.1 ; port USB_DS4_TXP
XCK_IO: P7.19
XTAL_IN: C122.2 U10.C6(XTALIN) Y4.1(OSC1)
XTAL_OUT: C121.2 U10.C7(XTALOUT) Y4.2(OSC2)
NetC125_1: C125.1 C126.1 L13.1 U10.B6(CVDDQ)
NetP8_1: P8.1 R36.1
NetP8_2: P8.2 U10.G4(PMODE0)
NetR34_1: R34.1 V4.1(A)
NetR37_1: R37.1 U10.H4(PMODE1)
NetR43_1: R43.1 U10.C8(R_USB2)
NetR44_1: R44.1 U10.B3(R_USB3)

Not connected (* = marked no-connect by the designer): RS12 3 6; U10 A11(NC) B11(TRST_N) C4(I2S-MCLK) C10(TDO) D1(I2S-CLK) D2(I2S-SD) D3(I2S-WS) D7(CLKIN) D11(I2C-GPIO60_CHARGER-DETECT)* E1(DQ29) E4(DQ31) E5(DQ30) E7(TDI) E8(TMS) F2(GPIO45) F3(DQ27) F4(DQ24) F5(DQ28) F6(TCK) G2(DQ25) G3(DQ26) H2(DQ22) H3(DQ23) H6(CTL9) J1(DQ21) J2(DQ19) J3(DQ20) J4(DQ17) K1(DQ18) K2(DQ16) K5(CTL10) L4(PMODE2)*; U11 1(DU1) 2(DU2) 3(E2) 7(~{WC}); U12 1(NC) 2(NC) 3(NC) 7(NC)

### Layout directives
differential pair: SST_N, SST_P, USB_DS4_DM, USB_DS4_RXM, USB_DS4_RXP, USB_DS4_TXM, USB_DS4_TXP

### Notes on the sheet
- GPIO0
- GPIO1
- GPIO2
- CYUSB3014-BZXC
- GPIO3
- GPIO4
- GPIO5
- GPIO6
- GPIO7
- GPIO8
- GPIO9
- GPIO10
- GPIO11
- GPIO12
- GPIO13
- GPIO14
- GPIO15
- GPIO16
- GPIO17
- GPIO18
- GPIO21
- GPIO22
- GPIO24
- (near P8) GPIO28
- (near P8) GPIO29
- (near P8) GPIO30
- (near P8) GPIO31
- Labels drawn without touching a wire or pin: CLK_IN, FX3_CTL8, FX3_CTL9, FX3_CTL10, FX3_DQ16, FX3_DQ17, FX3_DQ18, FX3_DQ19, FX3_DQ20, FX3_DQ21, FX3_DQ22, FX3_DQ23, FX3_DQ24, FX3_DQ25, FX3_DQ26, FX3_DQ27, FX3_DQ28, FX3_DQ29, FX3_DQ30, FX3_DQ31, FX3_GPIO45, FX3_I2S_CLK, FX3_I2S_MCLK, FX3_I2S_SD, FX3_I2S_WS
- (in symbol FX3_121_BUMP_0, part A) P - PORT; SEC 1/7; VIO1
- (in symbol FX3_121_BUMP_0, part B) S0 - PORT; SEC 2/7
- (in symbol FX3_121_BUMP_0, part C) S1 - PORT; SEC 3/7
- (in symbol FX3_121_BUMP_0, part D) U - PORT; SEC 4/7; VBUS/
- (in symbol FX3_121_BUMP_0, part E) XTAL / CLK; SEC 5/7
- (in symbol FX3_121_BUMP_0, part F) MISC; SEC 6/7
- (in symbol FX3_121_BUMP_0, part G) POWER; SEC 7/7

### Library data of the parts
C121 C122 = CAP CER SMT 4.3pF 0805: as C41 on sheet Cyusb3014 - 2; 6. Mounting Type: SMT; 5. Supplier Link: http://www.digikey.com/product-detail/en/C0805C439D5GACTU/C0805C439D5GACTU-ND/2212763; 3. Supplier: Digi-Key; 4. Supplier Part Number: C0805C439D5GACTU-ND
C124 = Cap: 50V/8.2u/0805; Value: 100n; Published: 8-Jun-2000; LatestRevisionDate: 17-Jul-2002; LatestRevisionNote: Re-released for DXP Platform.; PackageReference: RAD-0.3; Publisher: Altium Limited
C125 C126 C128-C148 C150-C160 = CAP0805: Capacitor; Value: 104; Published: 8-Jun-2000; Revision: July-2002: Re-released for DXP Platform.; Publisher: Altium Limited
C127 = CAP SMT 0.1uF 16V X7R: as C47 on sheet Cyusb3014 - 2; 6. Mounting Type: SMT; 5. Supplier Link: http://www.digikey.com/product-detail/en/C0805C104K4RACTU/399-1167-1-ND/411442; 3. Supplier: Digi-Key; 4. Supplier Part Number: 399-1167-1-ND
C149 = CAP: RC=1206
L13-L16 = Inductor: Code_IEC: 1005; Value: 10mH; Published: 8-Jun-2000; LatestRevisionDate: 29-May-2009; LatestRevisionNote: IPC-7351 Footprint Added.; PackageReference: 0402-A; Publisher: Altium Limited; PackageDescription: Chip Inductor; Code_JEITA: 0402
P7 = Header 30: Header, 30-Pin; LatestRevisionDate: 17-Jul-2002; LatestRevisionNote: Re-released for DXP Platform.; Publisher: Altium Limited
P8 = Header 2: Header, 2-Pin; LatestRevisionDate: 17-Jul-2002; LatestRevisionNote: Re-released for DXP Platform.; Publisher: Altium Limited
R34 = Res2: Resistor; Published: 8-Jun-2000; LatestRevisionDate: 17-Jul-2002; LatestRevisionNote: Re-released for DXP Platform.; PackageReference: AXIAL-0.4; Publisher: Altium Limited; Value: 10K
R35-R44 = Res2: Resistor; Value: 10K; Published: 8-Jun-2000; LatestRevisionDate: 17-Jul-2002; LatestRevisionNote: Re-released for DXP Platform.; PackageReference: AXIAL-0.4; Publisher: Altium Limited
RS10-RS12 = RN4: Option 2 - Device: *; Option 2 - Spec: *; Option 3 - Device: *; Option 3 - Spec: *; Option 4 - Device: *; Option 4 - Spec: *; Option 5 - Device: *; Option 5 - Spec: *; Option 6 - Device: *; Option 6 - Spec: *; Option 7 - Device: *; Option 7 - Spec: *; Option 8 - Device: *; Option 8 - Spec: *
U11 = 24LC64-I/SN: as U5 on sheet Cyusb3014 - 2; Supplier 1: Digi-Key; Manufacturer Part Number: 24LC64-I/SN; RoHS: RoHS Compliant; Category: Integrated Circuits (ICs); Stock 1: 16323; Pricing 1: 1=0.38, 25=0.37, 100=0.35 (USD); Packaging: Tube; Memory Type: EEPROM; Speed: 400kHz; Operating Temperature: -40°C ~ 85°C (TA); Package / Case: 8-SOIC (0.154", 3.90mm Width); Supplier Device Package: 8-SOIC; ComponentLink1URL: http://www.microchip.com/mymicrochip/filehandler.aspx?ddocname=en011843; ComponentLink1Description: http://www.microchip.com/mymicrochip/filehandler.aspx?ddocname=en011843; Supplier Part Number 1: 24LC64-I/SN-ND
U12 = AT24C128
V4 = LED0: Typical INFRARED GaAs LED; Published: 8-Jun-2000; LatestRevisionDate: 08-Jul-2005; LatestRevisionNote: Mech Layer 1 removed.; PackageReference: LED-0; Publisher: Altium Limited
Y4 = XTAL 32.768KHZ: as Y2 on sheet Cyusb3014 - 2; 5. Supplier Link: http://www.digikey.com/product-detail/en/ABS07-120-32.768KHZ-T/535-11937-1-ND/3724046; 3. Supplier: Digi-Key; 4. Supplier Part Number: 535-11937-1-ND

## Sheet Cyusb3314_Indicator.SchDoc
size 391 x 287 mm
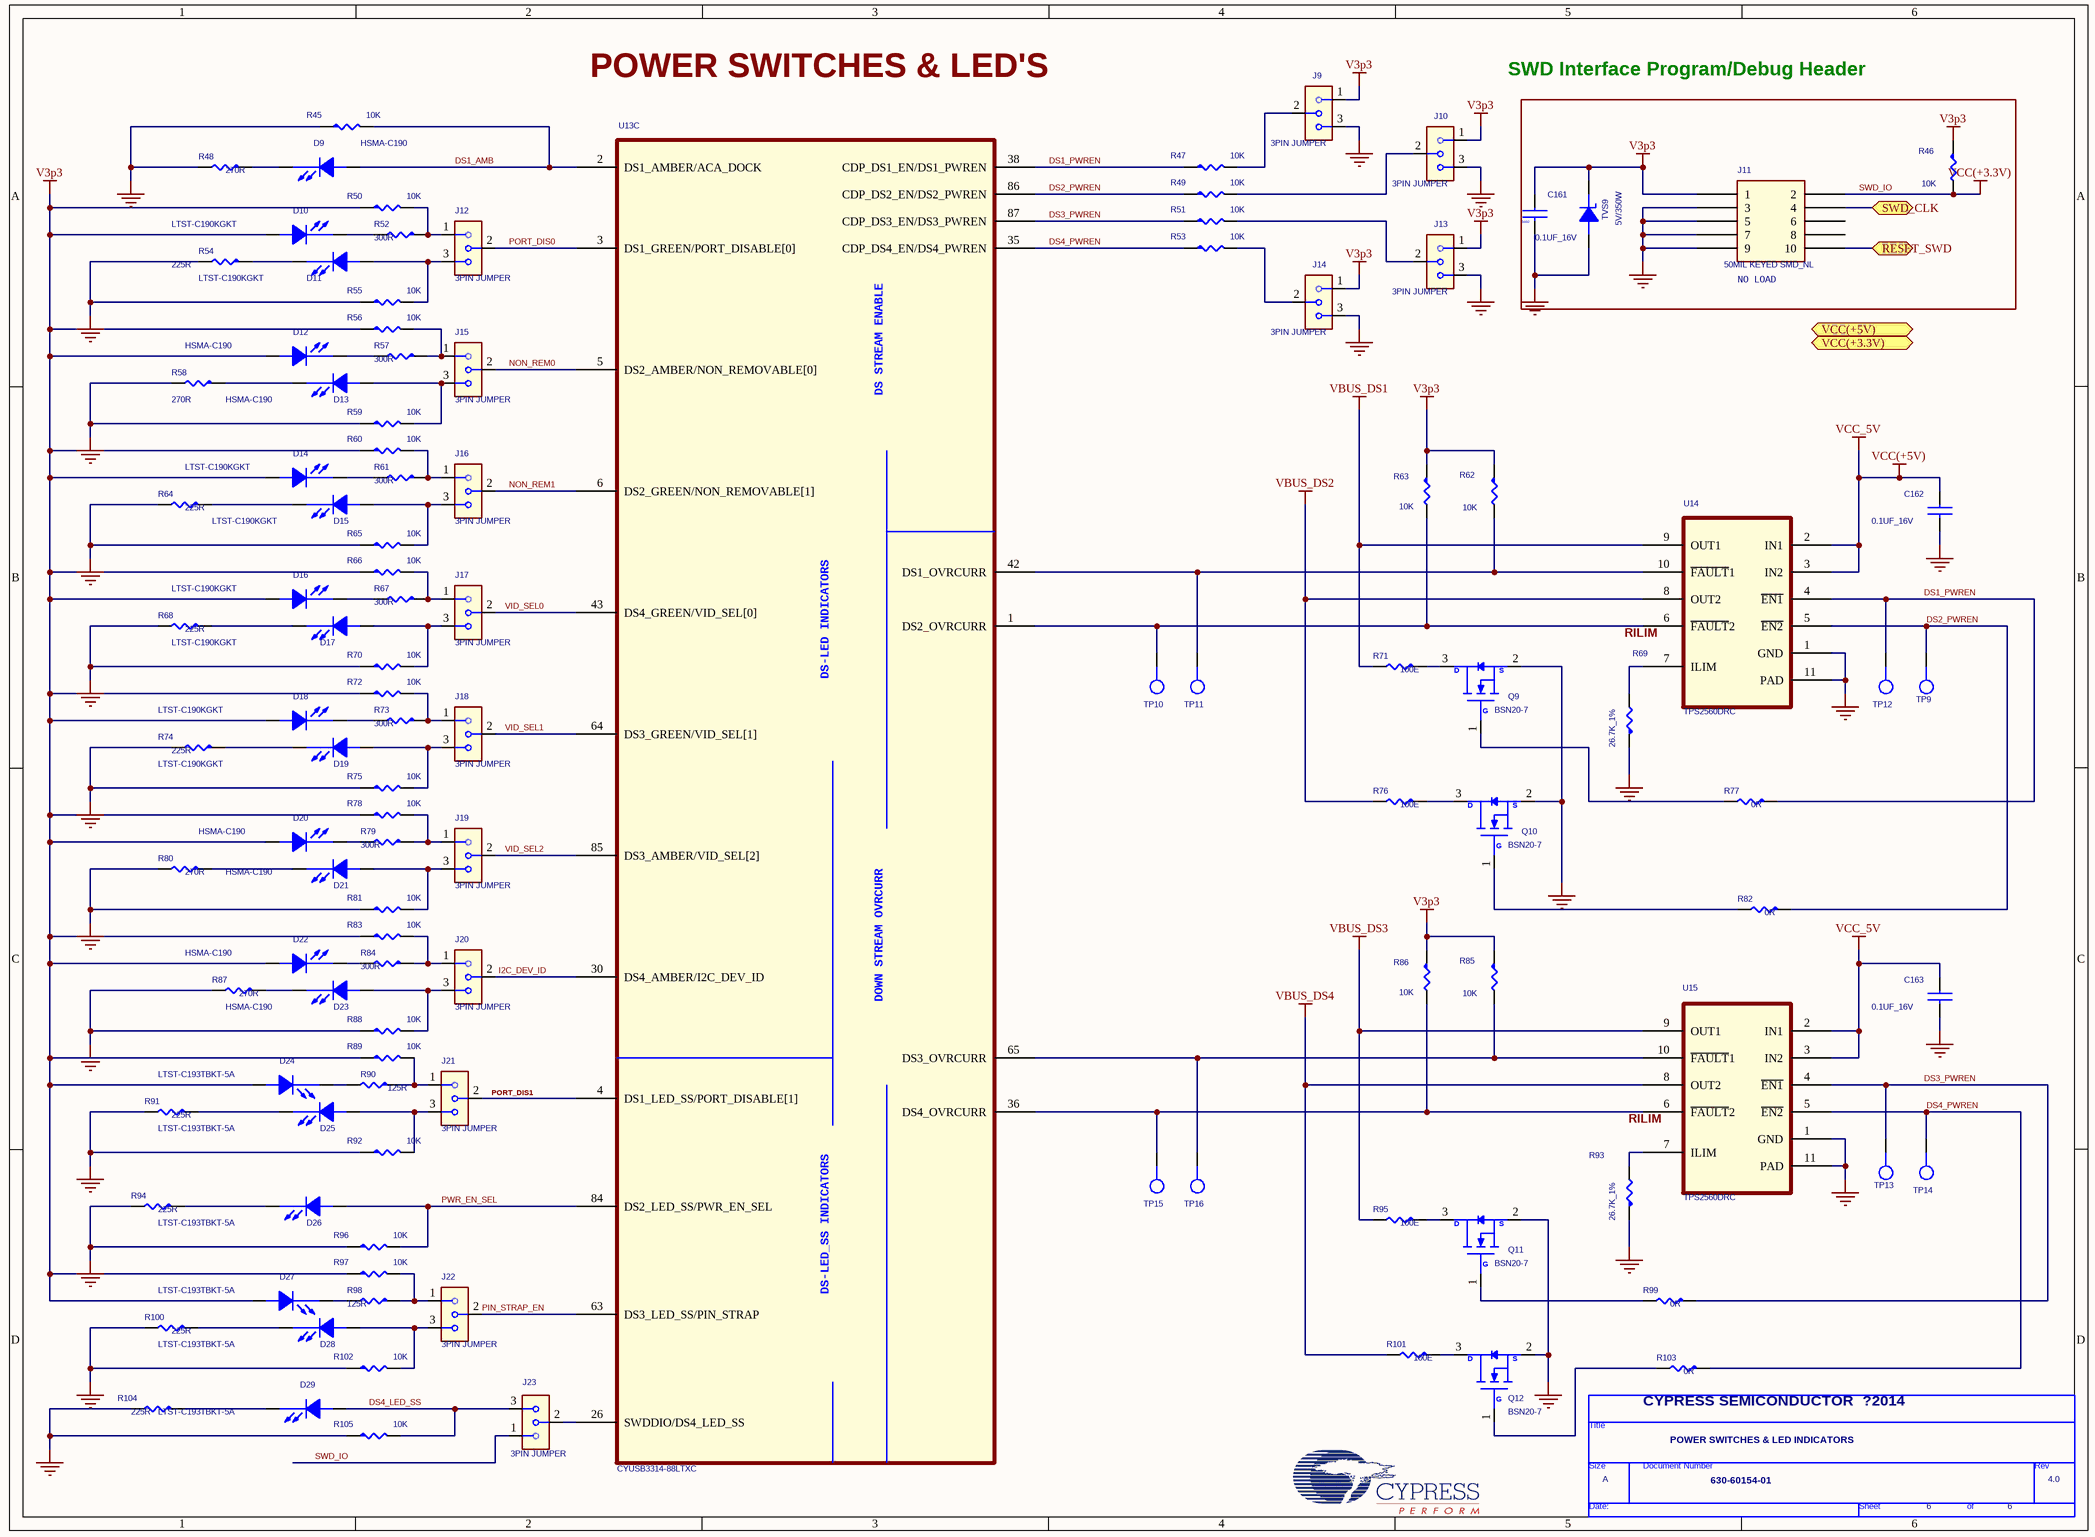
[diagram p4: Cyusb3314_Indicator.SchDoc]

### Parts
(Parts that share a designator on the sheet are numbered #1, #2 ... from top to bottom, then left to right.)
*#1  Page Count: 6  Page Size: A  Title: POWER SWITCHES & LED INDICATORS  RevCode: 4.0  Doc: 630-60154-01  (hidden comment: TitleBlock0)  (graphical)
C161  0.1UF_16V  [CAPC1005X55M]
C162  0.1UF_16V  [CAPC1005X56M]
C163  0.1UF_16V  [CAPC1005X56M]
D9  HSMA-C190  [LEDC1608X80M]
D10  LTST-C190KGKT  [LEDC1608X80M]
D11  LTST-C190KGKT  [LEDC1608X80M]
D12  HSMA-C190  [LEDC1608X80M]
D13  HSMA-C190  [LEDC1608X80M]
D14  LTST-C190KGKT  [LEDC1608X80M]
D15  LTST-C190KGKT  [LEDC1608X80M]
D16  LTST-C190KGKT  [LEDC1608X80M]
D17  LTST-C190KGKT  [LEDC1608X80M]
D18  LTST-C190KGKT  [LEDC1608X80M]
D19  LTST-C190KGKT  [LEDC1608X80M]
D20  HSMA-C190  [LEDC1608X80M]
D21  HSMA-C190  [LEDC1608X80M]
D22  HSMA-C190  [LEDC1608X80M]
D23  HSMA-C190  [LEDC1608X80M]
D24  LTST-C193TBKT-5A  [LEDC1608X35M]
D25  LTST-C193TBKT-5A  [LEDC1608X35M]
D26  LTST-C193TBKT-5A  [LEDC1608X35M]
D27  LTST-C193TBKT-5A  [LEDC1608X35M]
D28  LTST-C193TBKT-5A  [LEDC1608X35M]
D29  LTST-C193TBKT-5A  [LEDC1608X35M]
J9  3PIN JUMPER  [TE_3-644456-3]
J10  3PIN JUMPER  [TE_3-644456-3]
J11  50MIL KEYED SMD_NL  [SAMTEC_FTSH-105-01-L-DV-K]
J12  3PIN JUMPER  [TE_3-644456-3]
J13  3PIN JUMPER  [TE_3-644456-3]
J14  3PIN JUMPER  [TE_3-644456-3]
J15  3PIN JUMPER  [TE_3-644456-3]
J16  3PIN JUMPER  [TE_3-644456-3]
J17  3PIN JUMPER  [TE_3-644456-3]
J18  3PIN JUMPER  [TE_3-644456-3]
J19  3PIN JUMPER  [TE_3-644456-3]
J20  3PIN JUMPER  [TE_3-644456-3]
J21  3PIN JUMPER  [TE_3-644456-3]
J22  3PIN JUMPER  [TE_3-644456-3]
J23  3PIN JUMPER  [TE_3-644456-3]
Q9  BSN20-7  [SOT92P240X110-3M]
Q10  BSN20-7  [SOT92P240X110-3M]
Q11  BSN20-7  [SOT92P240X110-3M]
Q12  BSN20-7  [SOT92P240X110-3M]
R45  10K  [RESC1005X40M]
R46  10K  [RESC1005X40M]
R47  10K  [RESC1005X40M]
R48  270R  [RESC1608X50M]
R49  10K  [RESC1005X40M]
R50  10K  [RESC1005X40M]
R51  10K  [RESC1005X40M]
R52  300R  [RESC2012X65M]
R53  10K  [RESC1005X40M]
R54  225R  [RESC1608X50M]
R55  10K  [RESC1005X40M]
R56  10K  [RESC1005X40M]
R57  300R  [RESC2012X65M]
R58  270R  [RESC1608X50M]
R59  10K  [RESC1005X40M]
R60  10K  [RESC1005X40M]
R61  300R  [RESC2012X65M]
R62  10K  [RESC1005X40M]
R63  10K  [RESC1005X40M]
R64  225R  [RESC1608X50M]
R65  10K  [RESC1005X40M]
R66  10K  [RESC1005X40M]
R67  300R  [RESC2012X65M]
R68  225R  [RESC1608X50M]
R69  26.7K_1%  [RESC1005X40M]
R70  10K  [RESC1005X40M]
R71  100E  [RESC1608X50M]
R72  10K  [RESC1005X40M]
R73  300R  [RESC2012X65M]
R74  225R  [RESC1608X50M]
R75  10K  [RESC1005X40M]
R76  100E  [RESC1608X50M]
R77  0R  [RESC1608X50M]
R78  10K  [RESC1005X40M]
R79  300R  [RESC2012X65M]
R80  270R  [RESC1608X50M]
R81  10K  [RESC1005X40M]
R82  0R  [RESC1608X50M]
R83  10K  [RESC1005X40M]
R84  300R  [RESC2012X65M]
R85  10K  [RESC1005X40M]
R86  10K  [RESC1005X40M]
R87  270R  [RESC1608X50M]
R88  10K  [RESC1005X40M]
R89  10K  [RESC1005X40M]
R90  125R  [RESC2012X65M]
R91  225R  [RESC1608X50M]
R92  10K  [RESC1005X40M]
R93  26.7K_1%  [RESC1005X40M]
R94  225R  [RESC1608X50M]
R95  100E  [RESC1608X50M]
R96  10K  [RESC1005X40M]
R97  10K  [RESC1005X40M]
R98  125R  [RESC2012X65M]
R99  0R  [RESC1608X50M]
R100  225R  [RESC1608X50M]
R101  100E  [RESC1608X50M]
R102  10K  [RESC1005X40M]
R103  0R  [RESC1608X50M]
R104  225R  [RESC1608X50M]
R105  10K  [RESC1005X40M]
TP9  TP_YEL  [KEYSTONE_5000]  (value not drawn)
TP10  TEST POINT  [TP25C50]  (value not drawn)
TP11  TP_YEL  [KEYSTONE_5000]  (value not drawn)
TP12  TEST POINT  [TP25C50]  (value not drawn)
TP13  TP_YEL  [KEYSTONE_5000]  (value not drawn)
TP14  TEST POINT  [TP25C50]  (value not drawn)
TP15  TEST POINT  [TP25C50]  (value not drawn)
TP16  TP_YEL  [KEYSTONE_5000]  (value not drawn)
TVS9  5V/350W  [SOD2513X120M]
U13  CYUSB3314-88LTXC  [QFN40P1000X1000X100-89M]  (part C of 3)
U14  TPS2560DRC  [SON50P300X300X100-11M]
U15  TPS2560DRC  [SON50P300X300X100-11M]

### Blocks framed on the sheet
NO LOAD: C161 J11 R46 TVS9

### Ports
RESET_SWD (bidir), SWD_CLK (bidir), VCC(+3.3V) (in), VCC(+5V) (in)

### Nets
GND: C161.2 C162.2 C163.2 J9.3 J10.3 J11.3 J11.5 J11.7 J11.9 J13.3 J14.3 Q9.2(S) Q10.2(S) Q11.2(S) Q12.2(S) R45.1 R48.2 R54.2 R55.1 R58.2 R59.1 R64.2 R65.1 R68.2 R69.1 R70.1 R74.2 R75.1 R80.2 R81.1 R87.2 R88.1 R91.2 R92.1 R93.1 R94.2 R96.1 R100.2 R102.1 R104.2 R105.1 TVS9.2(A) U14.1(GND) U14.11(PAD) U15.1(GND) U15.11(PAD)
SWD_IO: C161.1 D10.1(ANODE) D12.1(ANODE) D14.1(ANODE) D16.1(ANODE) D18.1(ANODE) D20.1(ANODE) D22.1(ANODE) D24.1(ANODE) D27.1(ANODE) J9.1 J10.1 J11.1 J11.2 J13.1 J14.1 J23.1 R46.1 R46.2 R50.1 R56.1 R60.1 R62.1 R63.1 R66.1 R72.1 R78.1 R83.1 R85.1 R86.1 R89.1 R97.1 TVS9.1(K)  [also labelled V3p3, VCC(+3.3V)]
VBUS_DS1: R71.2 U14.9(OUT1)
VBUS_DS2: R76.2 U14.8(OUT2)
VBUS_DS3: R95.2 U15.9(OUT1)
VBUS_DS4: R101.2 U15.8(OUT2)
VCC(+5V): C162.1 C163.1 U14.2(IN1) U14.3(IN2) U15.2(IN1) U15.3(IN2)  [also labelled VCC_5V]
DS1_AMB: D9.1(ANODE) R45.2 U13.2(DS1_AMBER/ACA_DOCK)
DS1_PWREN: R47.1 R77.1 TP12.1(TP) U13.38(CDP_DS1_EN/DS1_PWREN) U14.4(~{EN1})
DS2_PWREN: R49.1 R82.1 TP9.1(TP) U13.86(CDP_DS2_EN/DS2_PWREN) U14.5(~{EN2})
DS3_PWREN: R51.1 R99.1 TP13.1(TP) U13.87(CDP_DS3_EN/DS3_PWREN) U15.4(~{EN1})
DS4_LED_SS: D29.1(ANODE) J23.3 R105.2
DS4_PWREN: R53.1 R103.1 TP14.1(TP) U13.35(CDP_DS4_EN/DS4_PWREN) U15.5(~{EN2})
I2C_DEV_ID: J20.2 U13.30(DS4_AMBER/I2C_DEV_ID)
NON_REM0: J15.2 U13.5(DS2_AMBER/NON_REMOVABLE[0])
NON_REM1: J16.2 U13.6(DS2_GREEN/NON_REMOVABLE[1])
PIN_STRAP_EN: J22.2 U13.63(DS3_LED_SS/PIN_STRAP)
PORT_DIS0: J12.2 U13.3(DS1_GREEN/PORT_DISABLE[0])
PORT_DIS1: J21.2 U13.4(DS1_LED_SS/PORT_DISABLE[1])
PWR_EN_SEL: D26.1(ANODE) R96.2 U13.84(DS2_LED_SS/PWR_EN_SEL)
VID_SEL0: J17.2 U13.43(DS4_GREEN/VID_SEL[0])
VID_SEL1: J18.2 U13.64(DS3_GREEN/VID_SEL[1])
VID_SEL2: J19.2 U13.85(DS3_AMBER/VID_SEL[2])
NetC188_1: J11.10 ; port RESET_SWD
NetD9_2: D9.2(CATHODE) R48.1
NetD10_2: D10.2(CATHODE) R52.2
NetD11_1: D11.1(ANODE) J12.3 R55.2
NetD11_2: D11.2(CATHODE) R54.1
NetD12_2: D12.2(CATHODE) R57.2
NetD13_1: D13.1(ANODE) J15.3 R59.2
NetD13_2: D13.2(CATHODE) R58.1
NetD14_2: D14.2(CATHODE) R61.2
NetD15_1: D15.1(ANODE) J16.3 R65.2
NetD15_2: D15.2(CATHODE) R64.1
NetD16_2: D16.2(CATHODE) R67.2
NetD17_1: D17.1(ANODE) J17.3 R70.2
NetD17_2: D17.2(CATHODE) R68.1
NetD18_2: D18.2(CATHODE) R73.2
NetD19_1: D19.1(ANODE) J18.3 R75.2
NetD19_2: D19.2(CATHODE) R74.1
NetD20_2: D20.2(CATHODE) R79.2
NetD21_1: D21.1(ANODE) J19.3 R81.2
NetD21_2: D21.2(CATHODE) R80.1
NetD22_2: D22.2(CATHODE) R84.2
NetD23_1: D23.1(ANODE) J20.3 R88.2
NetD23_2: D23.2(CATHODE) R87.1
NetD24_2: D24.2(CATHODE) R90.2
NetD25_1: D25.1(ANODE) J21.3 R92.2
NetD25_2: D25.2(CATHODE) R91.1
NetD26_2: D26.2(CATHODE) R94.1
NetD27_2: D27.2(CATHODE) R98.2
NetD28_1: D28.1(ANODE) J22.3 R102.2
NetD28_2: D28.2(CATHODE) R100.1
NetD29_2: D29.2(CATHODE) R104.1
NetJ9_2: J9.2 R47.2
NetJ10_2: J10.2 R49.2
NetJ11_4: J11.4 ; port SWD_CLK
NetJ12_1: J12.1 R50.2 R52.1
NetJ13_2: J13.2 R51.2
NetJ14_2: J14.2 R53.2
NetJ15_1: J15.1 R56.2 R57.1
NetJ16_1: J16.1 R60.2 R61.1
NetJ17_1: J17.1 R66.2 R67.1
NetJ18_1: J18.1 R72.2 R73.1
NetJ19_1: J19.1 R78.2 R79.1
NetJ20_1: J20.1 R83.2 R84.1
NetJ21_1: J21.1 R89.2 R90.1
NetJ22_1: J22.1 R97.2 R98.1
NetJ23_2: J23.2 U13.26(SWDDIO/DS4_LED_SS)
NetQ9_1: Q9.1(G) R77.2
NetQ9_3: Q9.3(D) R71.1
NetQ10_1: Q10.1(G) R82.2
NetQ10_3: Q10.3(D) R76.1
NetQ11_1: Q11.1(G) R99.2
NetQ11_3: Q11.3(D) R95.1
NetQ12_1: Q12.1(G) R103.2
NetQ12_3: Q12.3(D) R101.1
NetR62_2: R62.2 TP11.1(TP) U13.42(DS1_OVRCURR) U14.10(~{FAULT}1)
NetR63_2: R63.2 TP10.1(TP) U13.1(DS2_OVRCURR) U14.6(~{FAULT}2)
NetR69_2: R69.2 U14.7(ILIM)
NetR85_2: R85.2 TP16.1(TP) U13.65(DS3_OVRCURR) U15.10(~{FAULT}1)
NetR86_2: R86.2 TP15.1(TP) U13.36(DS4_OVRCURR) U15.6(~{FAULT}2)
NetR93_2: R93.2 U15.7(ILIM)

Not connected (* = marked no-connect by the designer): J11 6 8

### Notes on the sheet
- POWER SWITCHES & LED'S
- SWD Interface Program/Debug Header
- (near U14) RILIM
- (near U15) RILIM
- (near R103) CYPRESS SEMICONDUCTOR  ?2014
- (in symbol 0.1 uFd 0402) 0402
- (in symbol CYUSB3314-88LTXC_2, part C) DS STREAM ENABLE; DS-LED INDICATORS; DOWN STREAM OVRCURR; DS-LED_SS INDICATORS
- (in symbol TitleBlock0) Title; Size; Document Number; Rev; Date:; Sheet; of

### Library data of the parts
C161 = 0.1 uFd 0402: CAP .1UF 16V CERAMIC Y5V 0402; Cy_part#: 730R-10010; Manufacturer: Panasonic - ECG; Part Number: ECJ-0EF1C104Z; DEVICE: 0p1uFd_0402; CLASS: DISCRETE; ALT_SYMBOLS: C-CC0402_A; VOLTAGE: 16V; Created by: SNF
C162 C163 = CAPACITOR NON-POL: Manufacturer: *; Part Number: *
D9-D29 = LED: Manufacturer: *
  D9 D12 D13 D20-D23: Part Number: HSMA-C190
  D10 D11 D14-D19: Part Number: LTST-C190KGKT
  D24-D29: Part Number: LTST-C193TBKT-5A
J9 J12 J13 J15 J16 J18 J21-J23 = 3PIN JUM: CONN HEADER VERT 3POS .100 TIN; Part Number: 3-644456-3; Manufacturer: Tyco Electronics; Type: Single Row,3Pin Header
J10 J14 J17 J19 J20 = 3PIN JUM: CONN HEADER VERT 3POS .100 TIN; Manufacturer: Tyco Electronics; Part Number: 3-644456-3; Type: Single Row,3Pin Header
J11 = 10 Pin Header 50mil Keyed SMD: CONN HEADER 10 PIN 50MIL KEYED SMD; Part Number: FTSH-105-01-L-DV-K; Manufacturer: Samtec; Cy_part#: 420R-14312; CLASS: IO; Last Edit By: SNF; DEVICE: HDR5x2x50KS
Q9-Q12 = BSN20-7: MOSFET N-CH 50V 500MA SOT23; Manufacturer: Diodes Inc; PSpiceTemplate: X^@REFDES %D %G %S @MODEL; Part Number: BSN20-7
R45-R47 R49-R51 R53 R55 R60 R62 R65 R70 R72 R75 R78 R81 R86 R88 R89 R96 R97 R102 R105 = R_Dup1: as R126 on sheet Power; Lead Free: YES
R48 R52 R54 R57 R58 R61 R64 R67 R68 R71 R73 R74 R76 R77 R79 R80 R82 R84 R87 R90 R91 R94 R95 R98-R101 R103 R104 = R_Dup1: Lead Free: YES
  R48 R58: Value: 270R
  R54: Value: 225R
R56 R59 R63 R66 R83 R85 R92 = R_Dup1: RES 10.0K OHM 1/10W 1% 0603 SMD; Part Number: ERJ-3EKF1002V; Manufacturer: Panasonic - ECG; Lead Free: YES
R69 = R_Dup1: RES 28.0K OHM 1/10W 1% 0402 SMD; Manufacturer: Panasonic; Part Number: ERJ-2RKF2802X; Manufacturer Part Num: R5110402; Tolerance: 1%
R93 = R_Dup1: RES 28.0K OHM 1/10W 1% 0402 SMD; Part Number: ERJ-2RKF2802X; Manufacturer Part Num: R5110402; Manufacturer: Panasonic; Tolerance: 1%
TP9 TP13 = TP: TEST POINT PC MINI .040"D RED; Manufacturer: Keystone; Part Number: 5000
TP10 TP12 TP14 TP15 = TP
TP11 TP16 = TP: TEST POINT PC MINI .040"D RED; Part Number: 5000; Manufacturer: Keystone
TVS9 = TVS 5V SOD-323_0: TVS UNIDIR 350W 5V SOD-323; Part Number: SD05.TCT; Manufacturer: Dioded Inc.; CLASS: DISCRETE; DEVICE: SD05-7; LastEditBy: gir
U13 = CYUSB3314-88LTXC_2: Manufacturer: *; Part Number: CYUSB3314-88LTXC
*#1 = TitleBlock0: Page Number: 6; Page Create Date: March  8, 1995
U14 U15 = TPS2560DRC: Part Number: TPS2560DRC; Manufacturer: *